# EAGLE design Clyde_main_board (EAGLE 6.4)
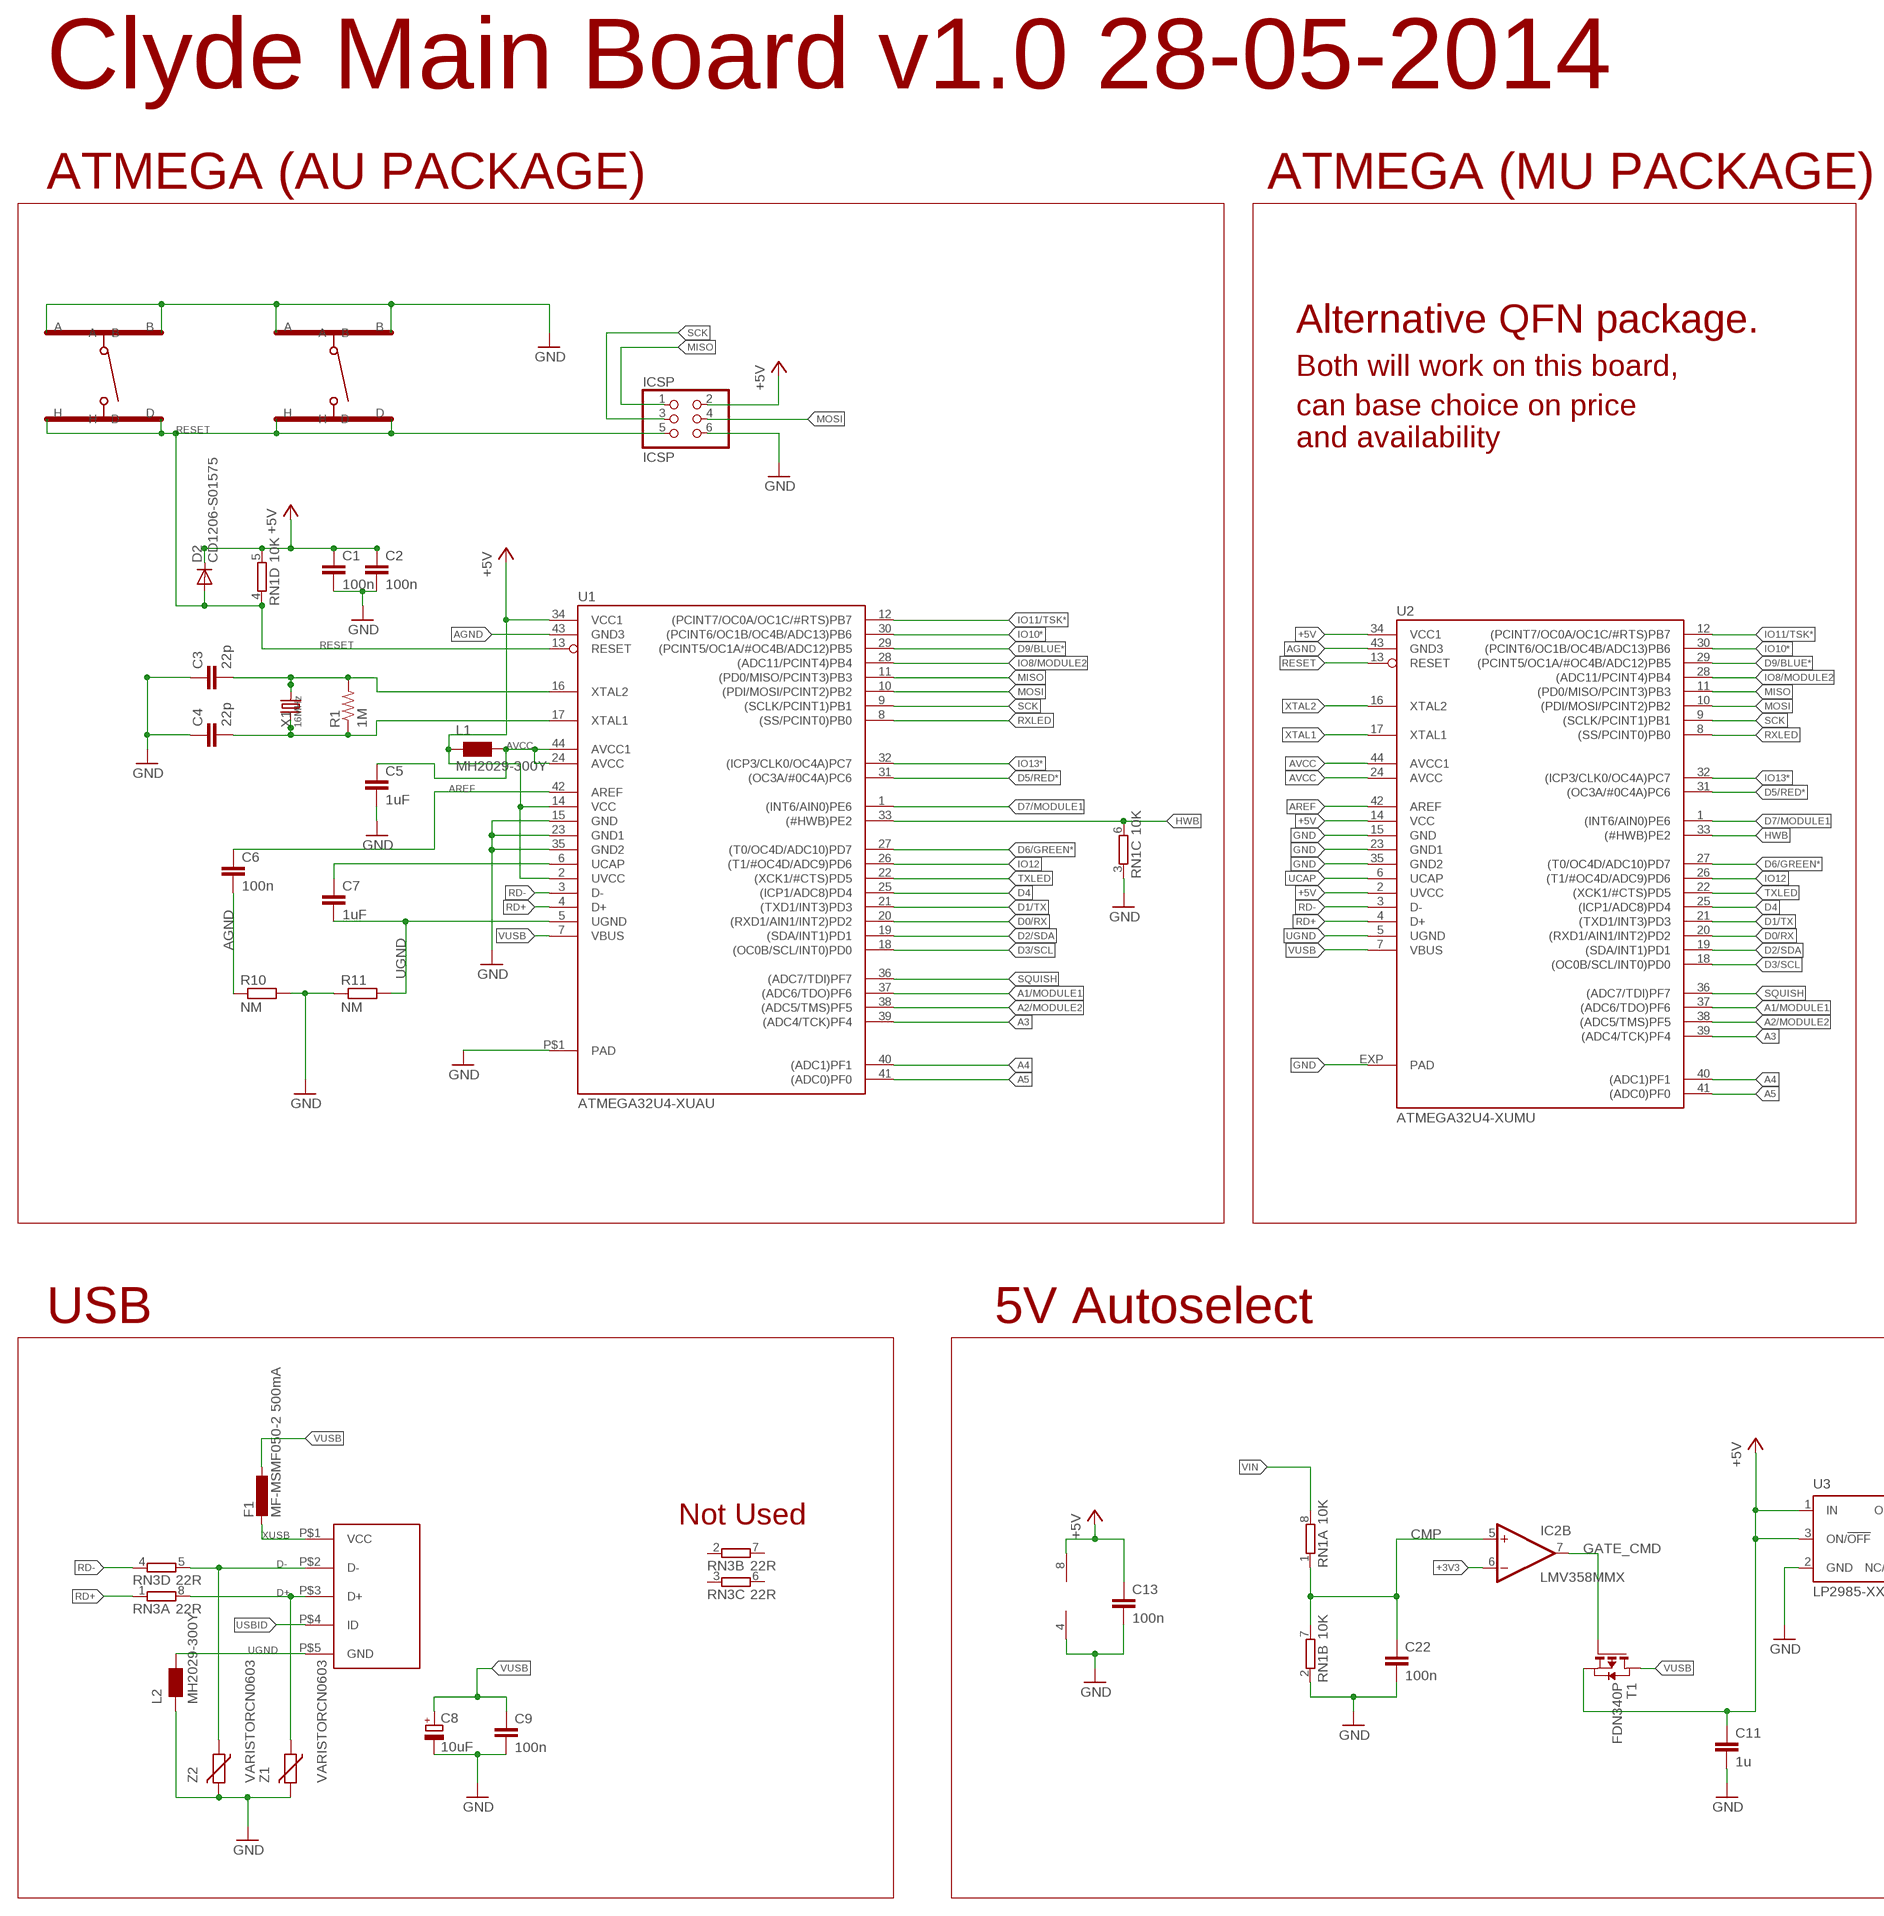
[diagram p0: schematic, sheet 1, part 1 of 2]
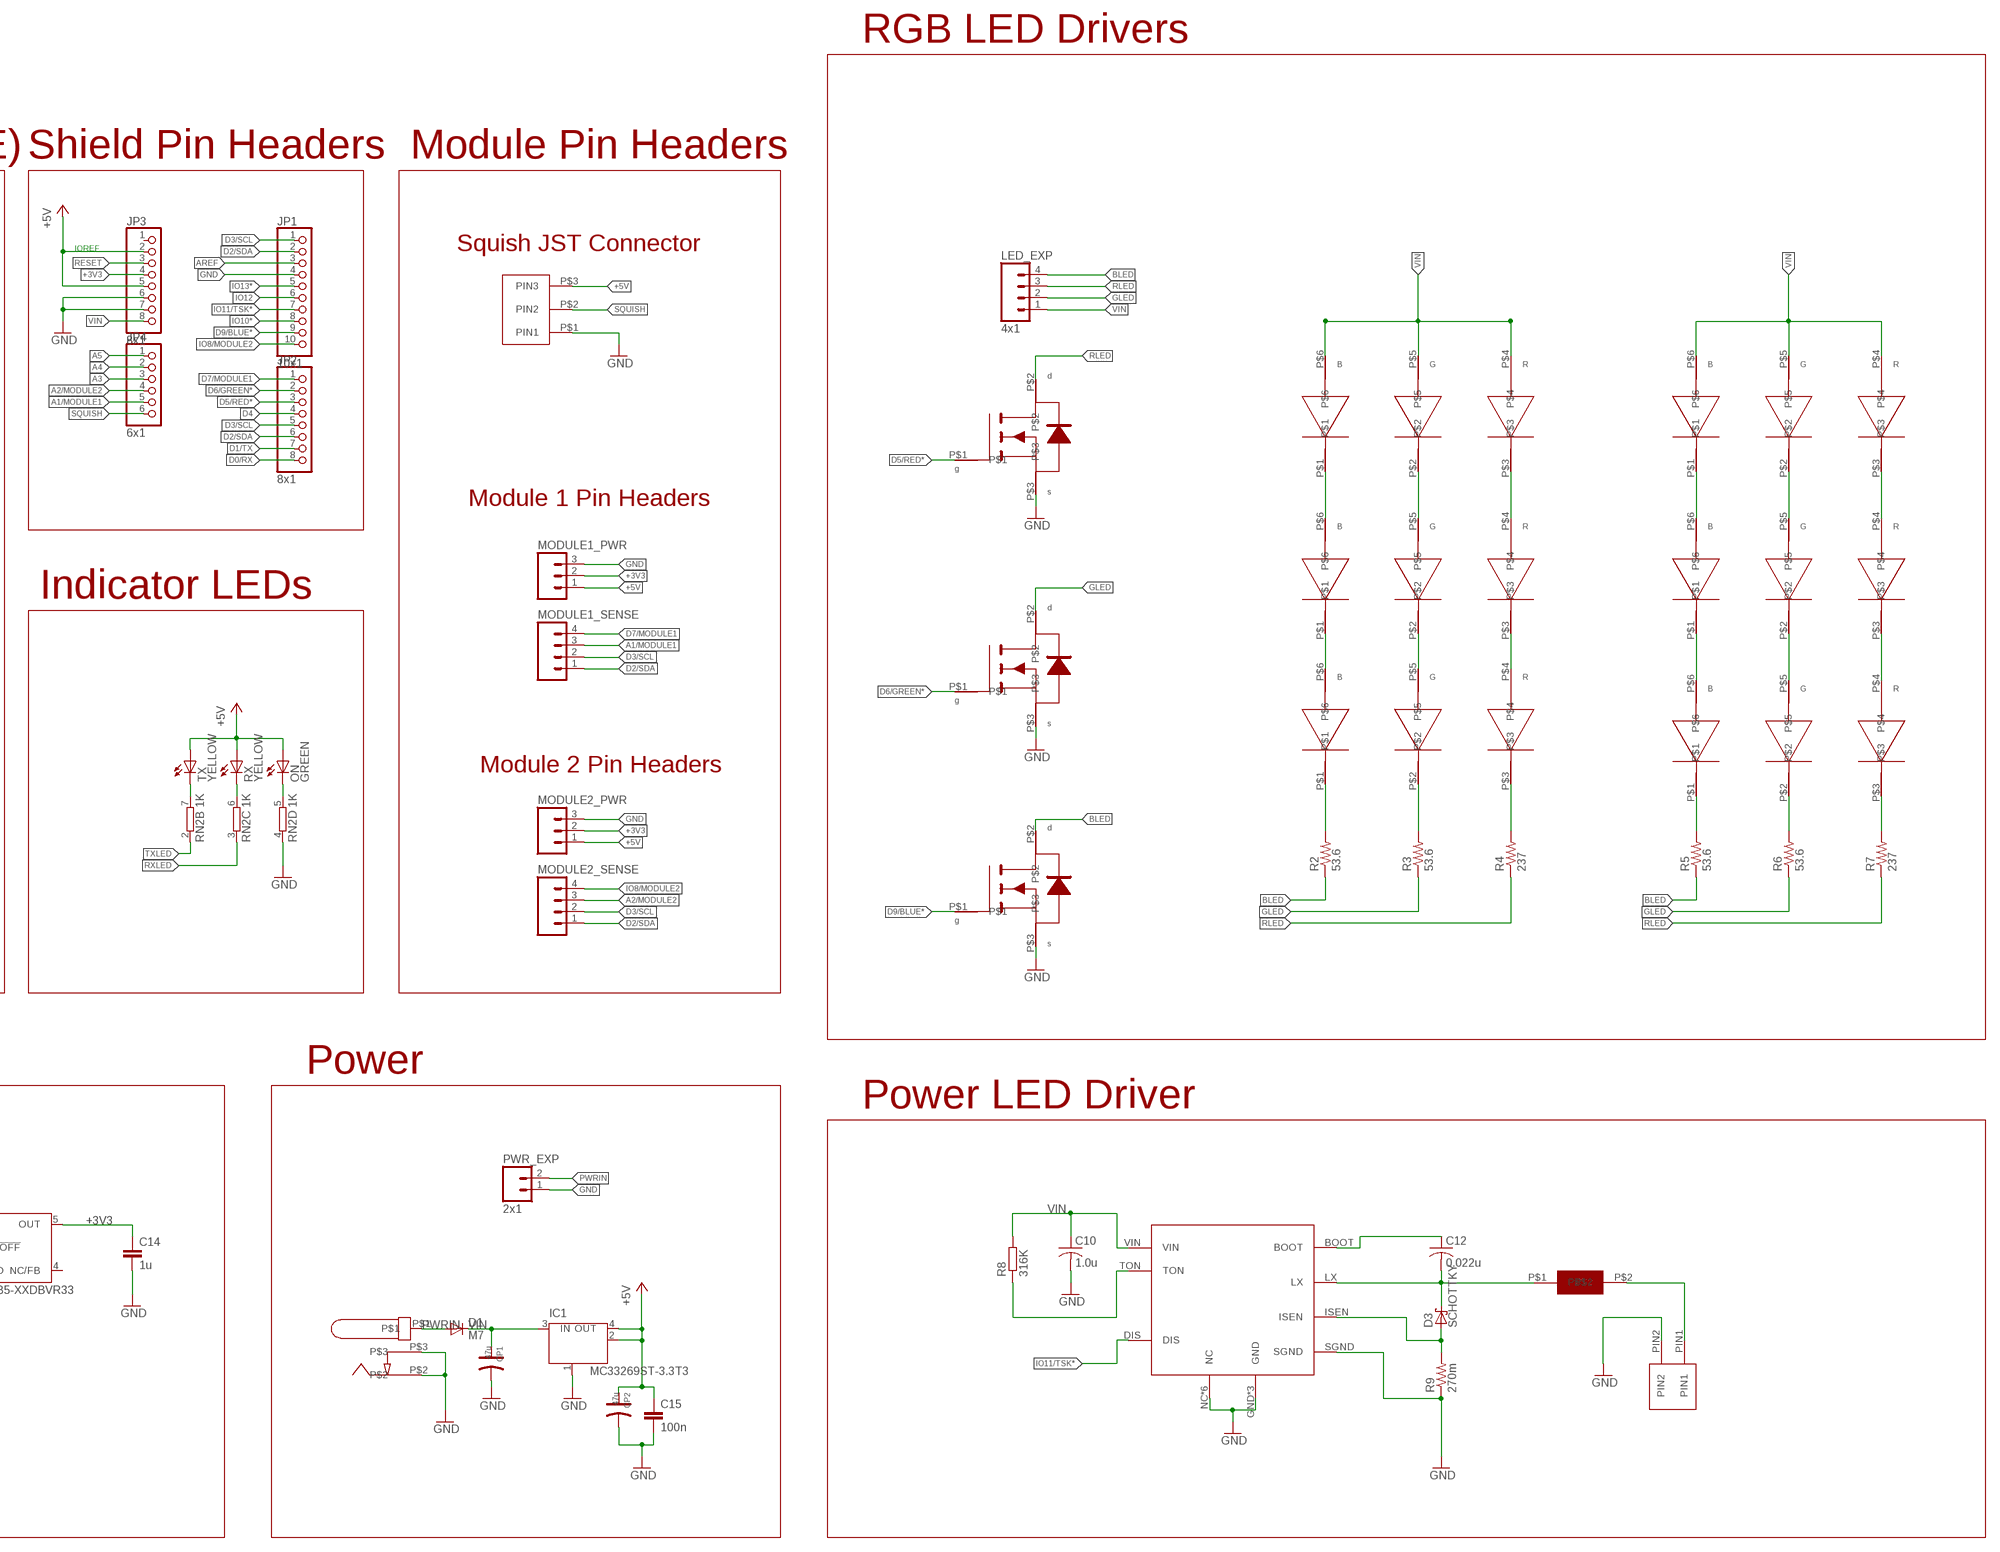
[diagram p1: schematic, sheet 1, part 2 of 2]

## Parts
2PIN_CONN  XH_JST_CONN_2POS_TOP  [XH_JST_CONN_2POS_TOP]
C1  100n  C-EUC0603  [C0603-ROUND]
C2  100n  C-EUC0603  [C0603-ROUND]
C3  22p  C-EUC0603  [C0603-ROUND]
C4  22p  C-EUC0603  [C0603-ROUND]
C5  1uF  C-EUC0603  [C0603-ROUND]
C6  100n  C-EUC0603  [C0603-ROUND]
C7  1uF  C-EUC0603  [C0603-ROUND]
C8  10uF  CPOL-EUSMCB  [SMC_B]
C9  100n  C-EUC0603  [C0603-ROUND]
C10  1.0u  C-USC1210  [C1210]
C11  1u  C-EUC0603  [C0603-ROUND]
C12  0.022u  C-USC0805  [C0805]
C13  100n  C-EUC0603  [C0603-ROUND]
C14  1u  C-EUC0603  [C0603-ROUND]
C15  100n  C-EUC0603  [C0603-ROUND]
C22  100n  C-EUC0603  [C0603-ROUND]
CP1  47u  CAP-ELECTRO-C  [ELECTRO-SMD-C-6MM]
CP2  47u  CAP-ELECTRO-C  [ELECTRO-SMD-C-6MM]
D1  M7  DIODE-SMB  [SMB]
D2  CD1206-S01575  DIODE-MINIMELF  [MINIMELF]
D3  SCHOTTKY  SCHOTTKY-DIODESMD  [SMB]
F1  MF-MSMF050-2 500mA  L-EUL1812  [L1812]
I_LEDDRIVER  TAIYO_YUDEN_6045_INDUCTOR  [TAIYO_YUDEN_6045_INDUCTOR]
IC1  MC33269ST-3.3T3  [SOT223]
IC2  LMV358MMX  [MSOP08]
ICSP  ICSP  PINHD-2X3  [2X03]
IR_CONNECT  XH_JST_CONN_3POS_SIDE_SMT  [XH_JST_CONN_3POS_SIDE_SMT]
J1  MOLEX_VERT_MINIUSB  [MOLEX_VERT_MINIUSB]
JP1  10x1  PINHD-1X10  [1X10]
JP2  8x1  PINHD-1X8  [1X08]
JP3  8x1  PINHD-1X8  [1X08]
JP4  6x1  PINHD-1X6  [1X06]
L1  MH2029-300Y  WE-CBF_0805  [0805]
L2  MH2029-300Y  WE-CBF_0805  [0805]
LED_EXP  4x1  M04LONGPADS  [1X04_LONGPADS]
MODULE1_PWR  M03PTH  [1X03]
MODULE1_SENSE  M04PTH  [1X04]
MODULE2_PWR  M03PTH  [1X03]
MODULE2_SENSE  M04PTH  [1X04]
ON  GREEN  LEDCHIPLED_0603  [CHIPLED_0603]
PWR_EXP  2x1  M023.5MM  [SCREWTERMINAL-3.5MM-2]
PWR_JACK  VERT_PWRJACK_PJ-006A_CUIINC  [VERT_PWRJACK_PJ-006A_CUIINC]
R1  1M  RESISTOR0805-RES  [0805]
R2  53.6  R-US_R0603  [R0603]
R3  53.6  R-US_R0603  [R0603]
R4  237  R-US_R0603  [R0603]
R5  53.6  R-US_R0603  [R0603]
R6  53.6  R-US_R0603  [R0603]
R7  237  R-US_R0603  [R0603]
R8  316K  R-EU_R0603  [R0603-ROUND]
R9  270m  R-US_R0805  [R0805]
R10  NM  R_0402_NM  [R0402_NM]
R11  NM  R_0402_NM  [R0402_NM]
RGB1  HANGZHOU_MULTICOLOR_3535WSA  [HANGZHOU_MULTCOLOR_3535WSZ]
RGB2  HANGZHOU_MULTICOLOR_3535WSA  [HANGZHOU_MULTCOLOR_3535WSZ]
RGB3  HANGZHOU_MULTICOLOR_3535WSA  [HANGZHOU_MULTCOLOR_3535WSZ]
RGB4  HANGZHOU_MULTICOLOR_3535WSA  [HANGZHOU_MULTCOLOR_3535WSZ]
RGB5  HANGZHOU_MULTICOLOR_3535WSA  [HANGZHOU_MULTCOLOR_3535WSZ]
RGB6  HANGZHOU_MULTICOLOR_3535WSA  [HANGZHOU_MULTCOLOR_3535WSZ]
RN1  10K  4R-NCAY16  [CAY16]
RN2  1K  4R-NCAY16  [CAY16]
RN3  22R  4R-NCAY16  [CAY16]
RST  COMAX_MINISWITCH  [COMAX_MINISWITCH]
RST1  COMAX_MINISWITCH  [COMAX_MINISWITCH]
RX  YELLOW  LEDCHIPLED_0603  [CHIPLED_0603]
T1  FDN340P  PMOSSOT23  [SOT-23]
TBLUE  SI2302DS_MOSFET  [SI2302DS_MOSFET]
TGREEN  SI2302DS_MOSFET  [SI2302DS_MOSFET]
TRED  SI2302DS_MOSFET  [SI2302DS_MOSFET]
TX  YELLOW  LEDCHIPLED_0603  [CHIPLED_0603]
U1  ATMEGA32U4-XUAU  [TQFP44-PAD]
U2  ATMEGA32U4-XUMU  [QFN44ML7X7]
U3  LP2985-XXDBVR33  [SOT23-DBV]
U4  ALLEGRO_A6210  [ALLEGRO_A6210]
X1  16MHz  XTAL_THRU_SMD  [XTAL_THRU_SMT]
Z1  VARISTORCN0603  [CT/CN0603]
Z2  VARISTORCN0603  [CT/CN0603]

## Nets
+3V3: C14.1 IC2.6(B:-IN) JP3.4 MODULE1_PWR.2 MODULE2_PWR.2 U3.5(OUT)
+5V: C1.1 C2.1 C11.1 C13.1 C15.1 CP2.+ D2.C IC1.2(OUT) IC1.4(OUT) IC2.8(P:V+) ICSP.2 IR_CONNECT.P$3(PIN3) JP3.2 JP3.5 L1.1 MODULE1_PWR.1 MODULE2_PWR.1 ON.A RN1.5 RX.A T1.2(S) TX.A U1.2(UVCC) U1.14(VCC) U1.34(VCC1) U2.2(UVCC) U2.14(VCC) U2.34(VCC1) U3.1(IN) U3.3(ON/!OFF)
A1/MODULE1: JP4.5 MODULE1_SENSE.3 U1.37((ADC6/TDO)PF6) U2.37((ADC6/TDO)PF6)
A2/MODULE2: JP4.4 MODULE2_SENSE.3 U1.38((ADC5/TMS)PF5) U2.38((ADC5/TMS)PF5)
A3: JP4.3 U1.39((ADC4/TCK)PF4) U2.39((ADC4/TCK)PF4)
A4: JP4.2 U1.40((ADC1)PF1) U2.40((ADC1)PF1)
A5: JP4.1 U1.41((ADC0)PF0) U2.41((ADC0)PF0)
AGND: C6.2 R10.1 U1.43(GND3) U2.43(GND3)
AREF: C6.1 JP1.3 U1.42(AREF) U2.42(AREF)
AVCC: C5.1 L1.2 U1.24(AVCC) U1.44(AVCC1) U2.24(AVCC) U2.44(AVCC1)
BLED: LED_EXP.4 R2.1 R5.1 TBLUE.P$2
CMP: C22.1 IC2.5(B:+IN) RN1.1 RN1.7
D0/RX: JP2.8 U1.20((RXD1/AIN1/INT2)PD2) U2.20((RXD1/AIN1/INT2)PD2)
D1/TX: JP2.7 U1.21((TXD1/INT3)PD3) U2.21((TXD1/INT3)PD3)
D2/SDA: JP1.2 JP2.6 MODULE1_SENSE.1 MODULE2_SENSE.1 U1.19((SDA/INT1)PD1) U2.19((SDA/INT1)PD1)
D3/SCL: JP1.1 JP2.5 MODULE1_SENSE.2 MODULE2_SENSE.2 U1.18((OC0B/SCL/INT0)PD0) U2.18((OC0B/SCL/INT0)PD0)
D4: JP2.4 U1.25((ICP1/ADC8)PD4) U2.25((ICP1/ADC8)PD4)
D5/RED*: JP2.3 TRED.P$1 U1.31((OC3A/#0C4A)PC6) U2.31((OC3A/#0C4A)PC6)
D6/GREEN*: JP2.2 TGREEN.P$1 U1.27((T0/OC4D/ADC10)PD7) U2.27((T0/OC4D/ADC10)PD7)
D7/MODULE1: JP2.1 MODULE1_SENSE.4 U1.1((INT6/AIN0)PE6) U2.1((INT6/AIN0)PE6)
D9/BLUE*: JP1.9 TBLUE.P$1 U1.29((PCINT5/OC1A/#OC4B/ADC12)PB5) U2.29((PCINT5/OC1A/#OC4B/ADC12)PB5)
D+: J1.P$3(D+) RN3.8 Z1.1
D-: J1.P$2(D-) RN3.5 Z2.1
GATE_CMD: IC2.7(B:OUT) T1.3(G)
GLED: LED_EXP.2 R3.1 R6.1 TGREEN.P$2
GND: 2PIN_CONN.PIN2 C1.2 C2.2 C3.1 C4.1 C5.2 C8.- C9.2 C10.2 C11.2 C13.2 C14.2 C15.2 C22.2 CP1.- CP2.- IC1.1(GND/ADJ) IC2.4(P:V-) ICSP.6 IR_CONNECT.P$1(PIN1) JP1.4 JP3.6 JP3.7 L2.1 MODULE1_PWR.3 MODULE2_PWR.3 PWR_EXP.1 PWR_JACK.P$2 PWR_JACK.P$3 R9.1 R10.2 R11.1 RN1.2 RN1.3 RN2.4 RST1.A RST1.B RST.A RST.B TBLUE.P$3 TGREEN.P$3 TRED.P$3 U1.15(GND) U1.23(GND1) U1.35(GND2) U1.P$1(PAD) U2.15(GND) U2.23(GND1) U2.35(GND2) U2.EXP(PAD) U3.2(GND) U4.GND U4.GND1(GND) U4.GND2(GND) U4.NC U4.NC1(NC) U4.NC2(NC) U4.NC3(NC) U4.NC4(NC) U4.NC5(NC) U4.SGND Z1.2 Z2.2
HWB: RN1.6 U1.33((#HWB)PE2) U2.33((#HWB)PE2)
IO8/MODULE2: JP1.10 MODULE2_SENSE.4 U1.28((ADC11/PCINT4)PB4) U2.28((ADC11/PCINT4)PB4)
IO10*: JP1.8 U1.30((PCINT6/OC1B/OC4B/ADC13)PB6) U2.30((PCINT6/OC1B/OC4B/ADC13)PB6)
IO11/TSK*: JP1.7 U1.12((PCINT7/OC0A/OC1C/#RTS)PB7) U2.12((PCINT7/OC0A/OC1C/#RTS)PB7) U4.DIS
IO12: JP1.6 U1.26((T1/#OC4D/ADC9)PD6) U2.26((T1/#OC4D/ADC9)PD6)
IO13*: JP1.5 U1.32((ICP3/CLK0/OC4A)PC7) U2.32((ICP3/CLK0/OC4A)PC7)
MISO: ICSP.1 U1.11((PD0/MISO/PCINT3)PB3) U2.11((PD0/MISO/PCINT3)PB3)
MOSI: ICSP.4 U1.10((PDI/MOSI/PCINT2)PB2) U2.10((PDI/MOSI/PCINT2)PB2)
N$5: R8.1 U4.TON
N$8: D3.A R9.2 U4.ISEN
N$9: C12.1 U4.BOOT
N$10: C12.2 D3.C I_LEDDRIVER.P$1 U4.LX
N$11: RN2.7 TX.C
N$12: RN2.6 RX.C
N$13: ON.C RN2.5
N$14: R2.2 RGB3.P$1
N$15: 2PIN_CONN.PIN1 I_LEDDRIVER.P$2
N$16: R3.2 RGB3.P$2
N$17: R4.2 RGB3.P$3
N$18: RGB2.P$1 RGB3.P$6
N$19: RGB2.P$2 RGB3.P$5
N$20: RGB2.P$3 RGB3.P$4
N$21: R5.2 RGB6.P$1
N$22: R6.2 RGB6.P$2
N$23: R7.2 RGB6.P$3
N$24: RGB5.P$1 RGB6.P$6
N$25: RGB5.P$2 RGB6.P$5
N$26: RGB5.P$3 RGB6.P$4
N$27: RGB4.P$3 RGB5.P$4
N$28: RGB4.P$2 RGB5.P$5
N$29: RGB4.P$1 RGB5.P$6
N$30: RGB1.P$3 RGB2.P$4
N$31: RGB1.P$2 RGB2.P$5
N$32: RGB1.P$1 RGB2.P$6
PWRIN: D1.A PWR_EXP.2 PWR_JACK.P$1
RD+: RN3.1 U1.4(D+) U2.4(D+)
RD-: RN3.4 U1.3(D-) U2.3(D-)
RESET: D2.A ICSP.5 JP3.3 RN1.4 RST1.D RST1.H RST.D RST.H U1.13(RESET) U2.13(RESET)
RLED: LED_EXP.3 R4.1 R7.1 TRED.P$2
RXLED: RN2.3 U1.8((SS/PCINT0)PB0) U2.8((SS/PCINT0)PB0)
SCK: ICSP.3 U1.9((SCLK/PCINT1)PB1) U2.9((SCLK/PCINT1)PB1)
SQUISH: IR_CONNECT.P$2(PIN2) JP4.6 U1.36((ADC7/TDI)PF7) U2.36((ADC7/TDI)PF7)
TXLED: RN2.2 U1.22((XCK1/#CTS)PD5) U2.22((XCK1/#CTS)PD5)
UCAP: C7.1 U1.6(UCAP) U2.6(UCAP)
UGND: C7.2 J1.P$5(GND) L2.2 R11.2 U1.5(UGND) U2.5(UGND)
USBID: J1.P$4(ID)
VIN: C10.1 CP1.+ D1.C IC1.3(IN) JP3.8 LED_EXP.1 R8.2 RGB1.P$4 RGB1.P$5 RGB1.P$6 RGB4.P$4 RGB4.P$5 RGB4.P$6 RN1.8 U4.VIN
VUSB: C8.+ C9.1 F1.1 T1.1(D) U1.7(VBUS) U2.7(VBUS)
XTAL1: C4.2 R1.1 U1.17(XTAL1) U2.17(XTAL1) X1.1 X1.P$1
XTAL2: C3.2 R1.2 U1.16(XTAL2) U2.16(XTAL2) X1.2 X1.P$2
XUSB: F1.2 J1.P$1(VCC)
Unconnected: IC2.1(A:OUT) IC2.2(A:-IN) IC2.3(A:+IN) JP3.1 RN2.1 RN2.8 RN3.2 RN3.3 RN3.6 RN3.7 U3.4(NC/FB)

## Notes on the sheet
- RGB LED Drivers
- Clyde Main Board v1.0 28-05-2014
- ATMEGA (AU PACKAGE) | ATMEGA (MU PACKAGE) | Shield Pin Headers | Module Pin Headers
- IOREF | Squish JST Connector
- Alternative QFN package.
- Both will work on this board,
- can base choice on price
  and availability
- Module 1 Pin Headers
- Indicator LEDs
- Module 2 Pin Headers
- USB | 5V Autoselect | Power
- Power LED Driver
- Not Used

## Library data of the parts
2PIN_CONN = fabule:XH_JST_CONN_2POS_TOP
C1-C7 C9 C11 C13-C15 C22 = SmartPrj:C-EU: CAPACITOR, European symbol
C8 = rcl:CPOL-EU: POLARIZED CAPACITOR, European symbol
C10 C12 = rcl:C-US: CAPACITOR, American symbol
CP1 CP2 = Discrete:CAP*: Electrolytic Capacitors,Tantalum Capacitors and Super Capacitors
D1 D2 = diode:DIODE-: DIODE
D3 = diode:SCHOTTKY-DIODE: Schottky Diode
F1 = rcl:L-EU: INDUCTOR, European symbol
I_LEDDRIVER = fabule:TAIYO_YUDEN_6045_INDUCTOR
IC1 = linear:MC33269ST*: Adjustable Output Low Dropout Voltage Regulator 800 mA Source: http://www.onsemi.com/pub/Collateral/MC33269-D.PDF
IC2 = linear:LMV358?*: Dual General Purpose, Low Voltage, Rail-to-Rail Output Operational Amplifiers Source: http://www.national.com/mpf/LM/LMV321.html http://www.national.com/dt/lmv_qual.pdf
ICSP = SmartPrj:PINHD-2X3: PIN HEADER
IR_CONNECT = fabule:XH_JST_CONN_3POS_SIDE_SMT
J1 = fabule:MOLEX_VERT_MINIUSB
JP1 = SmartPrj:PINHD-1X10: PIN HEADER
JP2 JP3 = SmartPrj:PINHD-1X8: PIN HEADER
JP4 = SmartPrj:PINHD-1X6: PIN HEADER
L1 L2 = wuerth-elektronik:WE-CBF: SMD EMI Suppression Ferrite Beads - excellent anti-EMI properties - low DCR - impedances till 3000 ohms - rated current up to 6 A
LED_EXP MODULE1_SENSE MODULE2_SENSE = SparkFun:M04: Header 4 Standard 4-pin 0.1" header. Use with straight break away headers (SKU : PRT-00116), right angle break away headers (PRT-00553), swiss pins (PRT-00743), machine pins (PRT-00117), and female headers (PRT-00115). Molex polarized connector foot print use with SKU : PRT-08231 with associated crimp pins and housings. 1MM SMD Version SKU: PRT-10208
MODULE1_PWR MODULE2_PWR = SparkFun:M03: Header 3 Standard 3-pin 0.1" header. Use with straight break away headers (SKU : PRT-00116), right angle break away headers (PRT-00553), swiss pins (PRT-00743), machine pins (PRT-00117), and female headers (PRT-00115). Molex polarized connector foot print use with SKU : PRT-08232 with associated crimp pins and housings.
ON RX TX = led:LED: LED OSRAM: - CHIPLED LG R971, LG N971, LY N971, LG Q971, LY Q971, LO R971, LY R971 LH N974, LH R974 LS Q976, LO Q976, LY Q976 LO Q996 - Hyper CHIPLED LW Q18S LB Q993, LB Q99A, LB R99A - SideLED LS A670, LO A670, LY A670, LG A670, LP A670 LB A673, LV A673, LT A673, LW A673 LH A674 LY A675 LS A676, LA A676, LO A676, LY A676, LW A676 LS A679, LY A679, LG A679 - Hyper Micro SIDELED® LS Y876, LA Y876, LO Y876, LY Y876 LT Y87S - SmartLED LW L88C, LW L88S LB L89C, LB L89S, LG L890 LS L89K, LO L89K, LY L89K LS L896, LA L896, LO L896, LY L896 - TOPLED LS T670, LO T670, LY T670, LG T670, LP T670 LSG T670, LSP T670, LSY T670, LOP T670, LYG T670 LG T671, LOG T671, LSG T671 LB T673, LV T673, LT T673, LW T673 LH T674 LS T676, LA T676, LO T676, LY T676, LB T676, LH T676, LSB T676, LW T676 LB T67C, LV T67C, LT T67C, LS T67K, LO T67K, LY T67K, LW E67C LS E67B, LA E67B, LO E67B, LY E67B, LB E67C, LV E67C, LT E67C LW T67C LS T679, LY T679, LG T679 LS T770, LO T770, LY T770, LG T770, LP T770 LB T773, LV T773, LT T773, LW T773 LH T774 LS E675, LA E675, LY E675, LS T675 LS T776, LA T776, LO T776, LY T776, LB T776 LHGB T686 LT T68C, LB T68C - Hyper Mini TOPLED® LB M676 - Mini TOPLED Santana® LG M470 LS M47K, LO M47K, LY M47K Source: http://www.osram.convergy.de LUXEON: - LUMILED® LXK2-PW12-R00, LXK2-PW12-S00, LXK2-PW14-U00, LXK2-PW14-V00 LXK2-PM12-R00, LXK2-PM12-S00, LXK2-PM14-U00 LXK2-PE12-Q00, LXK2-PE12-R00, LXK2-PE12-S00, LXK2-PE14-T00, LXK2-PE14-U00 LXK2-PB12-K00, LXK2-PB12-L00, LXK2-PB12-M00, LXK2-PB14-N00, LXK2-PB14-P00, LXK2-PB14-Q00 LXK2-PR12-L00, LXK2-PR12-M00, LXK2-PR14-Q00, LXK2-PR14-R00 LXK2-PD12-Q00, LXK2-PD12-R00, LXK2-PD12-S00 LXK2-PH12-R00, LXK2-PH12-S00 LXK2-PL12-P00, LXK2-PL12-Q00, LXK2-PL12-R00 Source: www.luxeon.com KINGBRIGHT: KA-3528ASYC Source: www.kingbright.com
PWR_EXP = SparkFun:M02: Header 2 Standard 2-pin 0.1" header. Use with straight break away headers (SKU : PRT-00116), right angle break away headers (PRT-00553), swiss pins (PRT-00743), machine pins (PRT-00117), and female headers (PRT-00115). Molex polarized connector foot print use with SKU : PRT-08233 with associated crimp pins and housings.
PWR_JACK = fabule:VERT_PWRJACK_PJ-006A_CUIINC
R1 = SparkFun:RESISTOR: Resistor Basic schematic elements and footprints for 0603, 1206, and PTH resistors.
R2-R7 = rcl:R-US_: RESISTOR, American symbol
R8 = SmartPrj:R-EU_: RESISTOR, European symbol
R9 = resistor:R-US_: RESISTOR, American symbol
R10 R11 = fabule:R_0402_NM
RGB1-RGB6 = fabule:HANGZHOU_MULTICOLOR_3535WSA
RN1-RN3 = resistor-dil:4R-N: Array Chip Resistor Source: RS Component / Phycomp; OC_FARNELL: unknown; OC_NEWARK: unknown
RST RST1 = fabule:COMAX_MINISWITCH
T1 = zetex:PMOSSOT23: MOS FET; OC_FARNELL: unknown; OC_NEWARK: unknown
TBLUE TGREEN TRED = fabule:SI2302DS_MOSFET
U1 U2 = SmartPrj:ATMEGA32U4-XU
U3 = SmartPrj:LP2985-XXDBVR: ULTRALOW-POWER 50-mA LOW-DROPOUT LINEAR REGULATORS 50-mA Low-Dropout Regulator Source: http://focus.ti.com/lit/ds/symlink/tps77001.pdf
U4 = fabule:ALLEGRO_A6210
X1 = fabule:XTAL_THRU_SMD
Z1 Z2 = varistor:VARISTOR: VARISTOR

## Board
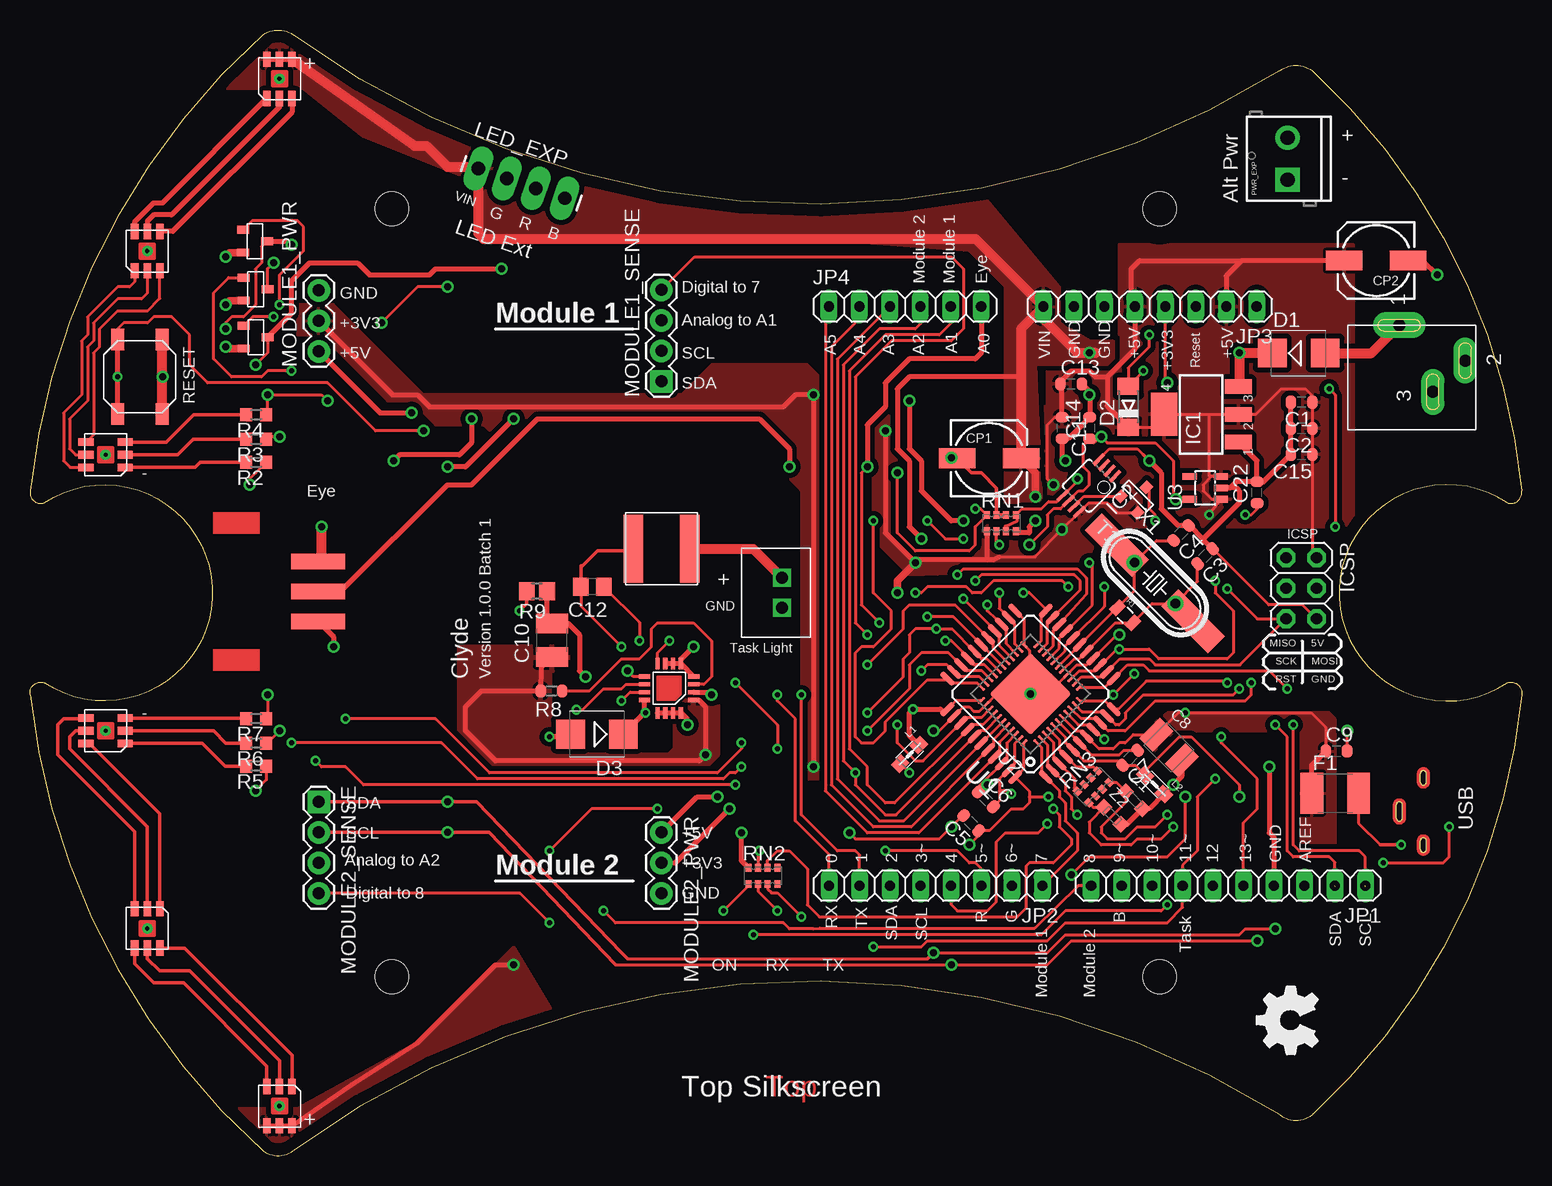
[diagram p2: board, top side]
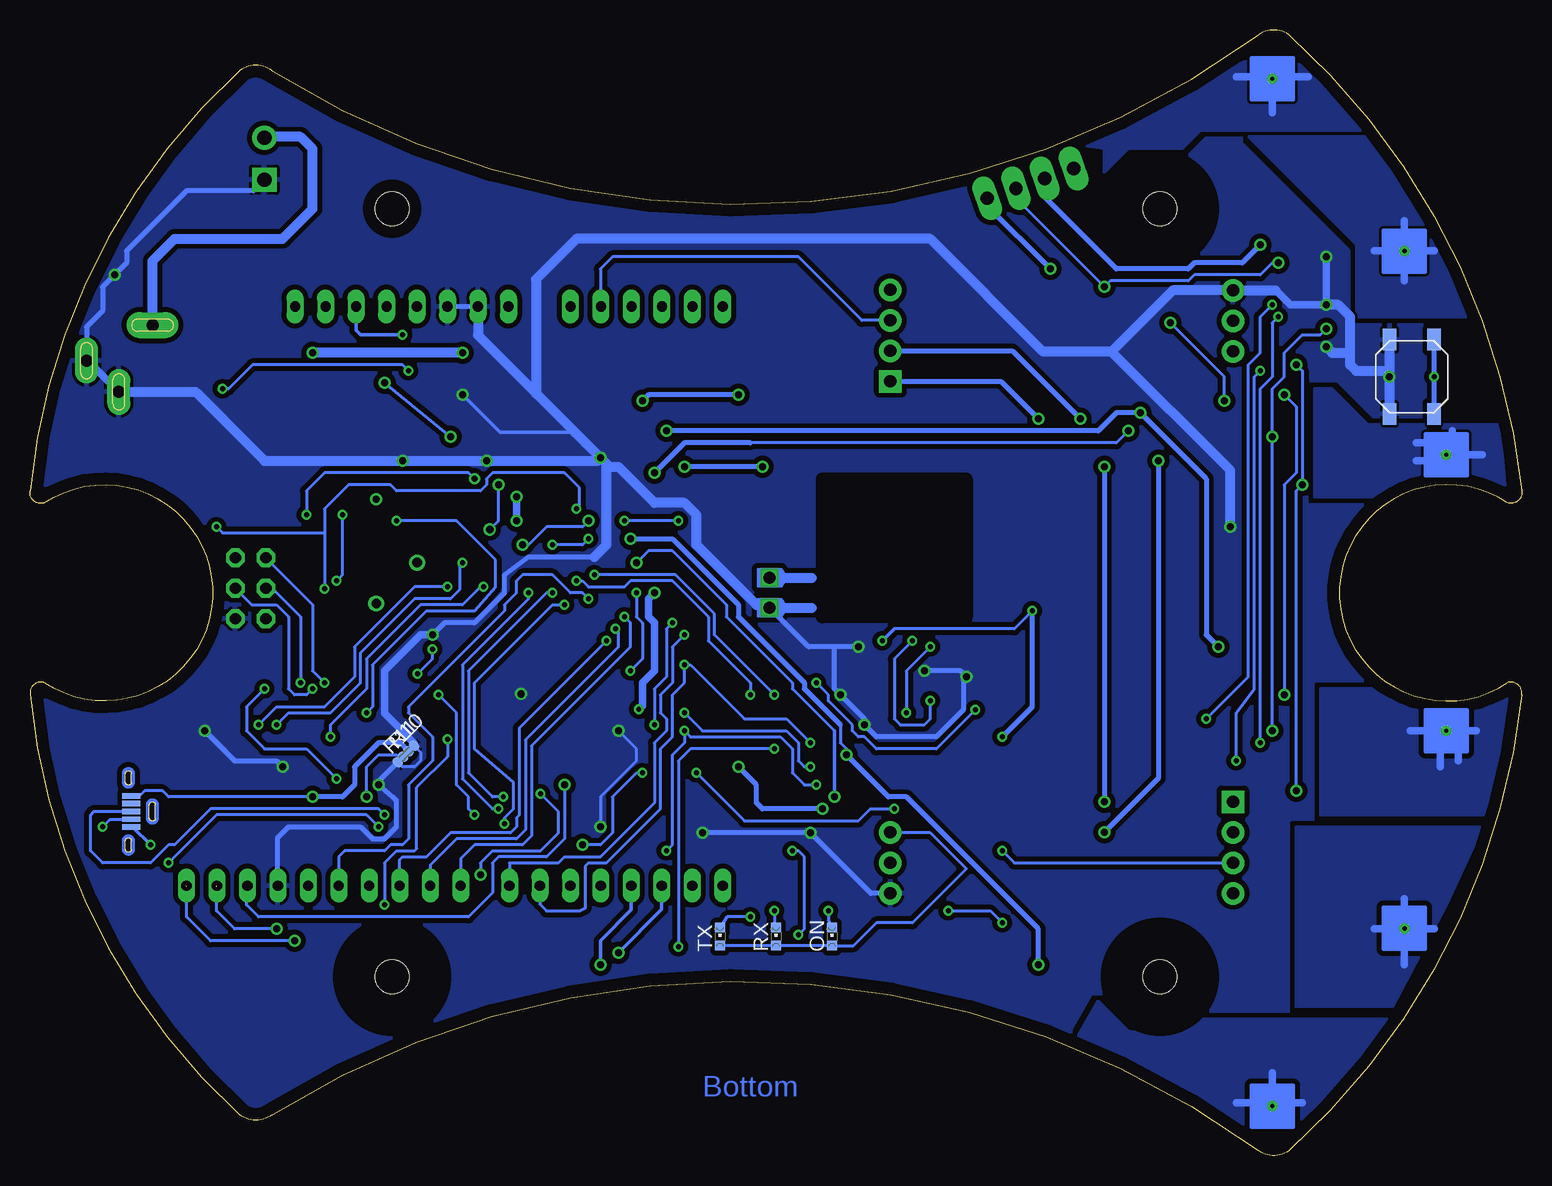
[diagram p3: board, bottom side, seen from below]

Size 124.36 x 93.8 mm. Coordinates in mm from the lower left corner, seen from the top.
Outline: 21.93,93.4 arc68 104.18,90.4 arc-75 106.89,90.4 arc-42 124.34,55.4 arc-120 123.15,54.4 arc247 123.15,39.4 arc-120 124.34,38.4 arc-42 106.89,3.4 arc-75 104.18,3.4 arc68 21.93,0.4 arc-71 19.43,0.4 arc-42 0.01,38.4 arc-120 1.19,39.4 arc247 1.19,54.4 arc-120 0.01,55.4 arc-42 19.43,93.4 arc-71 21.93,93.4
Copper layers (1*16): Top 0.035mm / dielectric 1.5mm / Bottom 0.035mm
Design rules "default *": minimum track width 10mil, minimum drill 0.3mm, track to track 8mil, track to pad 8mil, pad to pad 8mil, via to via 8mil, smd to smd 0mil, copper to edge 40mil, drill to drill 8mil, minimum pad ring 10mil, minimum via ring 8mil, stop-mask expansion 5mil, vias tented up to drill 0.6mm, thermal gap 10mil
Holes 2.8 mm at 94.17,78.9 94.17,14.9 30.17,78.9 30.17,14.9
tKeepout: area 91.6,76.4 to 96.7,81.4; area 91.6,12.4 to 96.7,17.4; area 27.6,76.4 to 32.7,81.4; area 27.6,12.4 to 32.7,17.4
bKeepout: area 89.7,74.4 to 98.7,83.4; area 25.7,74.4 to 34.7,83.4; area 89.7,74.4 to 98.7,83.4; area 25.7,10.4 to 34.7,19.4
tRestrict: area 27.6,76.4 to 32.7,81.4; area 91.6,12.4 to 96.7,17.4; area 91.6,76.4 to 96.7,81.4; area 27.6,12.4 to 32.7,17.4
bRestrict: area 89.7,10.4 to 98.7,19.4; area 25.7,74.4 to 34.7,83.4; area 89.7,10.4 to 98.7,19.4; area 25.7,10.4 to 34.7,19.4; area 46.3,44.9 to 58.3,56.4

### Footprints (pad centres in the part's own frame; a part is rotated, then mirrored left to right if it is on the bottom)
XH_JST_CONN_2POS_TOP = drill 1 square: PIN1 -1.25,0; PIN2 1.25,0
C0603-ROUND = smd 0.898 x 1.1: 1 -0.889,0; 2 0.889,0
SMC_B = smd 1.6 x 2.4: + -1.5,0; - 1.5,0
C1210 = smd 1.6 x 2.7: 1 -1.4,0; 2 1.4,0
C0805 = smd 1.3 x 1.5: 1 -0.95,0; 2 0.95,0
ELECTRO-SMD-C-6MM = smd 3.048 x 1.651: + 2.667,0; - -2.667,0
SMB = smd 2.4 x 2.4: A 2.2,0; C -2.2,0
MINIMELF = smd 1.4 x 1.8: A 1.7,0; C -1.7,0
L1812 = smd 1.9 x 3.4: 1 -1.95,0; 2 1.95,0
TAIYO_YUDEN_6045_INDUCTOR = smd 1.6 x 5.7: P$1 -2.35,0; P$2 2.35,0
SOT223 = smd 1.219 x 2.235: 1 -2.311,-3.099; 2 0,-3.099; 3 2.311,-3.099 | smd 3.6 x 2.2: 4 0,3.099
MSOP08 = smd 0.3 x 1.2: 1 -0.976,-2.113; 2 -0.326,-2.113; 3 0.324,-2.113; 4 0.974,-2.113; 5 0.974,2.112; 6 0.324,2.112; 7 -0.326,2.112; 8 -0.976,2.112
2X03 = drill 0.95 pad 1.55 octagon: 1 -2.54,-1.27; 2 -2.54,1.27; 3 0,-1.27; 4 0,1.27; 5 2.54,-1.27; 6 2.54,1.27
XH_JST_CONN_3POS_SIDE_SMT = smd 1.3 x 4.5: P$1 -2.5,2.25; P$2 0,2.25; P$3 2.5,2.25
MOLEX_VERT_MINIUSB = smd 0.45 x 1.5: P$1 -1.3,0.75; P$2 -0.65,0.75; P$3 0,0.75; P$4 0.65,0.75; P$5 1.3,0.75
1X10 = drill 0.85 pad 1.422 long: 1 -11.43,0; 2 -8.89,0; 3 -6.35,0; 4 -3.81,0; 5 -1.27,0; 6 1.27,0; 7 3.81,0; 8 6.35,0; 9 8.89,0; 10 11.43,0
1X08 = drill 0.85 pad 1.422 long: 1 -8.89,0; 2 -6.35,0; 3 -3.81,0; 4 -1.27,0; 5 1.27,0; 6 3.81,0; 7 6.35,0; 8 8.89,0
1X06 = drill 0.85 pad 1.422 long: 1 -6.35,0; 2 -3.81,0; 3 -1.27,0; 4 1.27,0; 5 3.81,0; 6 6.35,0
0805 = smd 1.2 x 1: 1 -1.1,0; 2 1.1,0
1X04_LONGPADS = drill 1.118 pad 1.88 long: 1 0,0; 2 2.54,0; 3 5.08,0; 4 7.62,0
1X03 = drill 1.016 pad 1.88: 1 0,0; 2 2.54,0; 3 5.08,0
1X04 = drill 1.016 pad 1.88 square: 1 0,0 | drill 1.016 pad 1.88: 2 2.54,0; 3 5.08,0; 4 7.62,0
CHIPLED_0603 = smd 0.8 x 0.8: A 0,-0.75; C 0,0.75
SCREWTERMINAL-3.5MM-2 = drill 1.2 pad 2.032 square: 1 0,0 | drill 1.2 pad 2.032: 2 3.5,0
VERT_PWRJACK_PJ-006A_CUIINC = drill 1 pad 2.184 long: P$1 4.35,0 | drill 1 pad 1.93 long: P$2 1.4,-5.5; P$3 -1.2,-2.8
0805' = smd 0.8 x 1.2: 1 -0.9,0; 2 0.9,0
R0603 = smd 1 x 1.1: 1 -0.85,0; 2 0.85,0
R0603-ROUND = smd 0.898 x 1.1: 1 -0.889,0; 2 0.889,0
R0805 = smd 1.3 x 1.5: 1 -0.85,0; 2 0.85,0
R0402_NM = smd 0.7 x 0.9: 1 -0.65,0; 2 0.65,0
HANGZHOU_MULTCOLOR_3535WSZ = smd 1.27 x 0.635: P$1 -1.635,1.05; P$2 -1.635,0; P$3 -1.635,-1.05; P$4 1.635,-1.05; P$5 1.635,0; P$6 1.635,1.05 | drill 0.35 pad 0.406: P$7 0,0
CAY16 = smd 0.5 x 0.65: 1 -1.2,-0.675; 2 -0.4,-0.675; 3 0.4,-0.675; 4 1.2,-0.675; 5 1.2,0.675; 6 0.4,0.675; 7 -0.4,0.675; 8 -1.2,0.675
COMAX_MINISWITCH = smd 1.8 x 1.1: A -3.1,-1.85; B 3.1,-1.85; D 3.1,1.85; H -3.1,1.85
SOT-23 = smd 0.787 x 0.889: 1 0.025,-1.016; 2 -0.94,1.016; 3 0.991,1.016
SI2302DS_MOSFET = smd 0.65 x 1: P$1 -0.95,-1; P$2 0,1; P$3 0.95,-1
TQFP44-PAD = smd 1.4 x 0.45: 1 -5.8,4; 2 -5.8,3.2; 3 -5.8,2.4; 4 -5.8,1.6; 5 -5.8,0.8; 6 -5.8,0; 7 -5.8,-0.8; 8 -5.8,-1.6; 9 -5.8,-2.4; 10 -5.8,-3.2; 11 -5.8,-4; 23 5.8,-4; 24 5.8,-3.2; 25 5.8,-2.4; 26 5.8,-1.6; 27 5.8,-0.8; 28 5.8,0; 29 5.8,0.8; 30 5.8,1.6; 31 5.8,2.4; 32 5.8,3.2; 33 5.8,4 | smd 0.45 x 1.4: 12 -4,-5.8; 13 -3.2,-5.8; 14 -2.4,-5.8; 15 -1.6,-5.8; 16 -0.8,-5.8; 17 0,-5.8; 18 0.8,-5.8; 19 1.6,-5.8; 20 2.4,-5.8; 21 3.2,-5.8; 22 4,-5.8; 34 4,5.8; 35 3.2,5.8; 36 2.4,5.8; 37 1.6,5.8; 38 0.8,5.8; 39 0,5.8; 40 -0.8,5.8; 41 -1.6,5.8; 42 -2.4,5.8; 43 -3.2,5.8; 44 -4,5.8 | smd 1 x 1: P$1 0,0
QFN44ML7X7 = smd 0.75 x 0.275: 1 -3.275,2.5; 2 -3.275,2; 3 -3.275,1.5; 4 -3.275,1; 5 -3.275,0.5; 6 -3.275,0; 7 -3.275,-0.5; 8 -3.275,-1; 9 -3.275,-1.5; 10 -3.275,-2; 11 -3.275,-2.5; 23 3.275,-2.5; 24 3.275,-2; 25 3.275,-1.5; 26 3.275,-1; 27 3.275,-0.5; 28 3.275,0; 29 3.275,0.5; 30 3.275,1; 31 3.275,1.5; 32 3.275,2; 33 3.275,2.5 | smd 0.275 x 0.75: 12 -2.5,-3.275; 13 -2,-3.275; 14 -1.5,-3.275; 15 -1,-3.275; 16 -0.5,-3.275; 17 0,-3.275; 18 0.5,-3.275; 19 1,-3.275; 20 1.5,-3.275; 21 2,-3.275; 22 2.5,-3.275; 34 2.5,3.275; 35 2,3.275; 36 1.5,3.275; 37 1,3.275; 38 0.5,3.275; 39 0,3.275; 40 -0.5,3.275; 41 -1,3.275; 42 -1.5,3.275; 43 -2,3.275; 44 -2.5,3.275 | smd 4.826 x 4.826: EXP 0,0
SOT23-DBV = smd 0.55 x 1.2: 1 -0.95,-1.3; 2 0,-1.3; 3 0.95,-1.3; 4 0.95,1.3; 5 -0.95,1.3
ALLEGRO_A6210 = smd 0.95 x 0.35: BOOT 2.05,0.325; DIS 2.05,-0.325; GND -2.05,-0.975; LX 2.05,0.975; NC -2.05,0.325; SGND 2.05,-0.975; TON -2.05,-0.325; VIN -2.05,0.975 | smd 0.35 x 0.95: GND1 -0.975,-2.05; GND2 -0.325,-2.05; ISEN 0.975,-2.05; NC1 -0.975,2.05; NC2 -0.325,2.05; NC3 0.325,2.05; NC4 0.975,2.05; NC5 0.325,-2.05
XTAL_THRU_SMT = drill 0.813: 1 -2.413,0; 2 2.413,0 | smd 5.5 x 2: P$1 -4.5,0; P$2 4.5,0
CT/CN0603 = smd 1 x 1: 1 -1,0; 2 1,0

### Placement (x,y rotation side)
2PIN_CONN  62.7,46.9 270 top
C1  106,62.78 180 top
C2  106,60.6 180 top
C3  97.96,49.94 225 top
C4  95.96,51.88 225 top
C5  78.46,27.7 135 top
C6  79.68,29.69 315 top
C7  91.71,33.14 225 top
C8  94.95,34.01 315 top
C9  108.9,33.7 0 top
C10  43.52,42.94 90 top
C11  86.03,60.63 270 top
C12  46.87,47.41 180 top
C13  86.8,64.3 0 top
C14  88.34,60.63 90 top
C15  106,58.43 180 top
C22  102.28,55.25 90 top
CP1  79.94,58.1 0 top
CP2  112.21,74.58 180 top
D1  105.75,66.87 0 top
D2  91.55,62.4 90 top
D3  47.25,35.1 180 top
F1  108.79,30.2 0 top
I_LEDDRIVER  52.64,50.56 0 top
IC1  97.63,61.76 90 top
IC2  88.28,55.81 135 top
ICSP  105.97,47.27 270 top
IR_CONNECT  21.76,47.01 270 top
J1  115.15,28.67 90 bottom
JP1  99.89,22.49 180 top
JP2  75.5,22.49 180 top
JP3  93.37,70.75 180 top
JP4  72.95,70.75 0 top
L1  73.32,33.43 225 top
L2  93.74,30.92 135 top
LED_EXP  37.36,82.26 341 top
MODULE1_PWR  24.07,67.02 90 top
MODULE1_SENSE  52.64,64.52 90 top
MODULE2_PWR  52.64,26.93 270 top
MODULE2_SENSE  24.07,29.47 270 top
ON  57.5,18.25 0 bottom
PWR_EXP  104.83,81.32 90 top
PWR_JACK  114.14,64.84 90 top
R1  1M  [0805']  91.3,45.02 315 top
R2  18.85,57.77 180 top
R3  18.85,59.69 180 top
R4  18.85,61.73 180 top
R5  18.85,32.45 180 top
R6  18.85,34.37 180 top
R7  18.85,36.41 180 top
R8  43.47,38.73 180 top
R9  42.25,47.02 180 top
R10  92.79,33.69 45 bottom
R11  93.24,33.24 45 bottom
RGB1  20.8,89.73 90 top
RGB2  9.78,75.37 90 top
RGB3  6.3,58.4 180 top
RGB4  20.8,4.13 270 top
RGB5  9.78,18.92 270 top
RGB6  6.3,35.4 180 top
RN1  80.97,52.7 180 top
RN2  61.09,23.3 180 top
RN3  88.63,30.72 225 top
RST  9.17,64.9 270 bottom
RST1  9.17,64.9 90 top
RX  62.17,18.25 0 bottom
T1  92.36,54.95 135 top
TBLUE  18.82,68.2 270 top
TGREEN  18.76,76.2 270 top
TRED  18.81,72.2 270 top
TX  66.84,18.25 0 bottom
U1  83.41,38.47 135 top
U2  83.41,38.47 135 top
U3  97.97,55.64 90 top
U4  53.28,38.94 180 top
U$1  [OSHW_FILLX200_NOTEXT]  107.34,8.44 90 top
X1  93.78,47.71 315 top
Z1  92.04,29.62 315 top
Z2  90.23,28.31 315 top

### Tracks (layer width: path | path; a pad name or v marks a point on that pad's centre or on a via)
+3V3  (via drill 0.6)
  Top 0.254: v95.51,54.69 95.3,54.9 95.3,57.9 93.8,59.4 89.8,59.4 v89.3,59.9 88.68,59.4 C14.1 87.8,59.2 87.8,57.4 88.3,56.9 88.3,55.9 87.8,55.4 87.41,55.4 IC2.6 85.91,53.9 85.3,53.9 84.8,53.4 84.8,52.4 v83.3,50.9 | v94.8,64.4 94.64,64.56 JP3.4
  Top 0.406: MODULE2_PWR.2 53.8,24.39 v58.3,28.9 | v73.3,62.9 73.3,58.9 74.3,57.9 74.3,55.4 76.8,52.9 v77.8,52.9 | MODULE1_PWR.2 30.23,63.4 32.3,63.4 33.3,62.4 62.8,62.4 63.8,63.4 v65.3,63.4 v65.3,32.4 | U3.5 v95.51,54.69
  Bottom 0.254: v89.3,59.9 v94.8,64.4 | v83.3,50.9 82.8,50.9 81.3,52.4 78.3,52.4 v77.8,52.9
  Bottom 0.406: v65.3,63.4 72.8,63.4 v73.3,62.9 | v58.3,28.9 63.3,28.9 63.8,29.4 63.8,30.9 v65.3,32.4
  pour Top (isolate 0.406, rank 3): 22.3,70.9 22.3,68.4 24.3,68.4 29.8,62.9 31.8,62.9 33.8,60.9 37.8,60.9 40.8,57.9 61.8,57.9 64.3,55.4 64.3,31.9 64.8,31.4 65.8,31.4 65.8,64.9 64.8,65.9 56.8,65.9 54.3,63.4 32.8,63.4 25.3,70.9
+5V  (via drill 0.4, 0.6)
  Top 0.254: C13.1 85.91,61.64 C11.1 85.42,61.52 84.8,60.9 84.8,56.4 v85.3,55.9 | D2.C 93.47,60.7 IC1.4 98.3,61.76 | 98.3,61.76 IC1.2 102.17,61.76 104.3,63.9 106.3,63.9 106.8,63.4 106.8,62.36 C1.1 C2.1 C15.1 106.89,50.17 ICSP.2 | 98.3,61.76 98.3,56.62 U3.3 98.5,56.59 97.8,55.9 97.8,55.4 98.51,54.69 U3.1 98.27,53.43 v98.3,53.4 | 76.18,36.9 U1.34 77.18,37.9 79.3,37.9 U2.34 | 89.21,40.8 U1.14 88.73,40.4 | 73.6,34.71 L1.1 | 80.8,49.9 83.75,49.9 | 83.75,49.9 83.8,49.9 | 88.73,40.4 87.46,40.4 U2.14 | U2.2 84.8,34.25 84.8,32.55 U1.2 86.3,31.05 86.3,30.4 86.8,29.9 86.8,28.9 v87.3,28.4 | 88.73,40.4 88.8,40.4 90.6,42.2 v90.8,42.2 93.3,42.2 94.1,41.4 99.8,41.4 100.3,41.9 100.3,45.4 98.8,46.9 v98.8,47.9 | v92.05,40.15 v90.3,38.4 | T1.2 90.63,53.57 89.8,54.4 88.25,54.4 IC2.8 v86.03,52.17 83.75,49.9
  Top 0.406: MODULE2_PWR.1 55.61,29.9 v57.3,29.9 | MODULE1_PWR.1 29.19,61.9 v31.8,61.9 | v71.3,60.4 71.3,51.9 v73.8,49.4 74.05,49.65 79.8,49.65 | 89.8,64.9 92.1,67.19 JP3.5 91.8,71.04 91.8,73.9 92.49,74.58 100.99,74.58 | 89.8,64.9 89.8,62.45 D2.C | C11.1 86.03,64.17 85.8,64.4 86.8,65.4 88.3,65.4 88.8,64.9 89.8,64.9 | CP2.+ 100.99,74.58 | 100.99,74.58 99.72,73.31 JP3.2 | 76.18,36.9 75.88,37.2 v73.6,37.2 73.3,36.9 73.3,35 L1.1 | 80.8,49.9 80.3,49.65 79.8,49.65 | RN1.5 79.77,49.68 79.8,49.65 | IR_CONNECT.P$3 25.3,43.21 v25.3,42.4
  Top 0.61: v73.8,49.4 72.3,47.9 v72.3,46.9
  Bottom 0.254: TX.A RX.A ON.A 55.7,17.5 53.8,19.4 50.8,19.4 46.3,23.9 49.34,26.93 MODULE2_PWR.1 | 57.3,35.4 60.8,38.9 60.8,39.4 66.3,44.9 66.3,45.9 70.8,50.4 72.8,50.4 v73.8,49.4 | v85.3,55.9 85.3,52.9 v86.03,52.17 | v98.8,47.9 98.3,48.4 v98.3,53.4 | v87.3,28.4 87.8,28.9 87.8,29.9 88.8,30.9 88.8,36.9 v90.3,38.4 | v92.05,40.15 90.8,41.4 v90.8,42.2 | v86.03,52.17
  Bottom 0.305: v57.3,29.9 57.3,35.4
  Bottom 0.406: v71.3,60.4 35.3,60.4 33.8,61.9 v31.8,61.9 26.3,56.4 26.3,43.4 v25.3,42.4
  Bottom 0.61: v72.3,46.9 72.8,46.4 72.8,44.9 72.3,44.4 72.3,40.4 73.3,39.4 73.3,37.49 v73.6,37.2
  pour Top (isolate 0.406, rank 2): 70.3,51.4 73.3,48.4 87.8,48.9 89.3,52.4 110.3,52.4 110.3,75.9 90.8,75.9 90.8,66.9 89.8,65.4 84.8,65.4 84.8,62.4 70.3,62.4
A1/MODULE1
  Top 0.254: JP4.5 76.76,69.35 75.8,68.4 71.3,68.4 68.3,65.4 68.3,33.9 69.8,32.4 69.8,30.9 71.3,29.4 72.07,29.4 U1.37 78.57,35.9 79.42,35.9 U2.37
  Bottom 0.254: MODULE1_SENSE.3 55,69.6 60.3,74.9 75.8,74.9 76.8,73.9 76.8,70.79 JP4.5
A2/MODULE2  (via drill 0.4)
  Top 0.254: JP4.4 74.22,69.31 73.8,68.9 70.8,68.9 67.8,65.9 67.8,32.9 v68.8,31.9 68.8,30.9 71.3,28.4 72.21,28.4 U1.38 | 78.74,34.84 U1.38 | v52.3,28.9 46.8,28.9 v43.3,25.4 | U2.38 79.63,35.4 79.21,35.4 U1.38
  Bottom 0.254: v68.8,31.9 64.8,27.9 55.3,27.9 54.3,28.9 v52.3,28.9 | v43.3,25.4 42.3,24.39 MODULE2_SENSE.3
A3
  Top 0.254: JP4.3 67.3,66.37 67.3,31.4 70.8,27.9 72.84,27.9 U1.39 U2.39
A4
  Top 0.254: JP4.2 69.14,69.73 66.8,67.4 66.8,30.9 70.3,27.4 73.47,27.4 U1.40 80.3,34.23 80.3,34.66 U2.40
A5
  Top 0.254: JP4.1 66.3,70.45 66.3,30.4 69.8,26.9 74.1,26.9 U1.41 80.8,33.6 80.8,34.45 U2.41
AGND  (via drill 0.4, 0.6)
  Top 0.254: 80.8,30.4 80.8,31.4 81.51,32.1 U1.43 82.08,32.62 82.08,34.32 U2.43 | 80.8,30.4 80.8,29.55 C6.2 | v86.8,23.4 88.3,24.9 94.8,24.9 96.3,26.4 v96.3,29.9 | v81.8,30.15 81.8,30.4 80.8,30.4
  Bottom 0.254: v86.8,23.4 86.8,24.4 85.8,25.4 81.8,25.4 80.3,26.9 80.3,28.65 v81.8,30.15 | v96.3,29.9 96.3,32.4 95.3,33.4 93.8,33.4 93.64,33.23 R10.1
AREF  (via drill 0.6)
  Top 0.254: U1.42 79.05,30.72 C6.1 | v79.8,30.9 79.8,31.47 U1.42 | U1.42 81.43,32.97 81.43,34.37 U2.42
  Bottom 0.254: JP1.3 106.3,22.42 106.3,20.9 105.3,19.9 87.8,19.9 85.8,21.9 85.8,24.4 85.3,24.9 81.3,24.9 79.8,26.4 v79.8,30.9
AVCC  (via drill 0.4, 0.6)
  Top 0.254: 72.3,32.41 L1.2 v73.3,31.9 | v78.3,25.9 79.09,26.68 C5.1 79.98,27.07 81.8,28.9 82.8,28.9 83.3,29.4 83.3,29.9 | v80.8,46.9 80.8,45.6 U1.24 82.1,44.3 82.1,42.65 U2.24 | U2.44 82.8,34.33 82.8,32.21 U1.44 83.3,30.37 83.3,29.9 | 83.3,29.9 v84.9,29.9
  Bottom 0.254: v78.3,25.9 76.8,25.9 75.8,26.9 75.8,29.9 73.8,31.9 v73.3,31.9 | v80.8,46.9 81.3,46.9 87.8,40.4 87.8,31.9 85.8,29.9 v84.9,29.9
BLED  (via drill 0.6)
  Top 0.254: R5.1 19.7,31.3 v18.8,30.4 | v18.3,55.9 18.3,56.4 18.8,56.9 18.83,56.9 R2.1 | TBLUE.P$2 19.82,66.92 v18.8,65.9
  Top 0.406: TBLUE.P$2 21.8,70.18 21.8,72.9 23.3,74.4 27.3,74.4 28.3,73.4 33.3,73.4 33.8,73.9 v39.3,73.9
  Bottom 0.254: v18.8,30.4 18.8,55.4 v18.3,55.9 18.3,65.4 v18.8,65.9
  Bottom 0.406: v39.3,73.9 44.57,79.16 LED_EXP.4
CMP  (via drill 0.4, 0.5)
  Top 0.254: RN1.7 81.3,52.09 81.3,52.45 82.3,52.9 82.3,53.37 RN1.1 | 82.17,53.27 RN1.1 | RN1.1 82.7,53.9 84.3,53.9 84.91,54.5 85.6,54.5 IC2.5 87.3,56.21 v87.3,56.4 | v101.3,53.4 101.8,53.4 102.28,53.88 C22.1
  Bottom 0.254: v87.3,56.4 87.8,56.9 99.8,56.9 101.3,55.4 v101.3,53.4
D0/RX  (via drill 0.4)
  Top 0.254: JP2.8 66.61,25.09 63.8,27.9 63.8,36.4 62.3,37.9 v62.3,38.4 | v77.3,48.4 77.8,48.9 87.3,48.9 88.05,48.15 88.05,46.76 U1.20 85.3,43.76 85.3,42.48 U2.20
  Bottom 0.254: v62.3,38.4 67.3,43.4 67.3,45.15 70.55,48.4 v77.3,48.4
D1/TX  (via drill 0.4)
  Top 0.254: JP2.7 69.15,25.05 68.8,25.4 67.3,25.4 64.3,28.4 v64.3,38.4 | v78.8,47.9 79.3,48.4 87.05,48.4 87.55,47.9 87.55,47.15 U1.21 84.8,44.39 84.8,42.69 U2.21
  Bottom 0.254: v78.8,47.9 78.3,47.9 77.8,47.4 74.8,47.4 74.3,47.9 70.8,47.9 67.8,44.9 67.8,42.9 64.3,39.4 v64.3,38.4
D2/SDA  (via drill 0.4, 0.6)  (1 unrouted)
  Top 0.254: JP1.2 108.78,24.42 108.3,24.9 105.3,24.9 104.8,25.4 104.8,34.9 v103.8,35.9 | v75.3,16.9 84.8,16.9 86.3,18.4 100.8,18.4 101.3,18.9 v103.8,18.9 | 49.8,16.4 74.8,16.4 | v88.3,49.4 88.55,49.15 88.55,45.88 U1.19 85.8,43.13 85.8,42.28 U2.19
  Top 0.305: MODULE2_SENSE.1 v34.8,29.47 37.23,29.47 49.3,16.9 49.8,16.4 | 74.8,16.4 v75.3,16.9
  Top 0.406: v40.3,61.4 36.3,57.4 v34.8,57.4
  Bottom 0.254: v103.8,35.9 102.8,36.9 99.3,36.9 96.8,39.4 96.8,41.9 92.3,46.4 89.3,46.4 88.55,47.15 88.55,49.15 v88.3,49.4 | v103.8,18.9 107.3,18.9 108.8,20.4 108.8,22.4 | 108.52,22.49 JP1.2
  Bottom 0.305: v75.3,16.9 71.69,20.51 JP2.6
  Bottom 0.406: MODULE1_SENSE.1 43.42,64.52 v40.3,61.4 | v34.8,57.4 v34.8,29.47
D3/SCL  (via drill 0.4, 0.6)  (1 unrouted)
  Top 0.254: 48.8,15.9 v76.8,15.9 84.8,15.9 86.8,17.9 v102.3,17.9 | JP1.1 111.3,22.5 111.3,24.9 110.8,25.4 105.8,25.4 105.3,25.9 v105.3,35.9 | v89.55,47.4 89.55,45.74 U1.18 86.3,42.49 86.3,42.07 U2.18
  Top 0.305: MODULE2_SENSE.2 v34.8,26.93 38.27,26.93 48.8,15.9
  Top 0.406: v36.8,61.4 36.8,59.4 35.8,58.4 30.8,58.4 v30.3,57.9
  Bottom 0.254: v105.3,35.9 103.8,37.4 99.8,37.4 97.3,39.9 97.3,42.4 92.3,47.4 v89.55,47.4 | v102.3,17.9 109.3,17.9 111.3,19.9 111.3,22.4 | 111.06,22.49 JP1.1
  Bottom 0.305: v76.8,15.9 76.8,17.9 74.23,20.47 JP2.5
  Bottom 0.406: MODULE1_SENSE.2 42.46,67.06 v36.8,61.4 | v30.3,57.9 30.3,31.43 v34.8,26.93
D4  (via drill 0.4)
  Top 0.254: JP2.4 76.77,20.93 77.3,20.4 79.8,20.4 80.55,21.15 80.55,26.15 81.3,26.9 84.05,26.9 v84.8,27.65 | 81.4,43.9 81.3,43.97 U1.25 81,44.2 | U2.25 81.4,42.65 81.4,43.9 | 81.4,43.9 79.8,45.4 v79.8,45.9
  Bottom 0.254: v79.8,45.9 80.8,45.9 87.3,39.4 87.3,33.9 84.34,31.36 84.09,31.15 84.05,31.11 84.05,28.9 84.8,28.15 v84.8,27.65
D5/RED*  (via drill 0.4)
  Top 0.254: U2.31 79.36,40.4 78.08,40.4 U1.31 76.58,41.9 74.3,41.9 73.3,40.9 73.3,38.9 v69.8,35.4 | v58.8,30.9 27.8,30.9 26.3,32.4 24.3,32.4 v23.8,32.9 | JP2.3 79.31,23.89 78.8,24.4 78.3,24.4 77.3,25.4 v71.3,25.4 | v21.8,65.4 19.8,65.4 19.3,64.9 16.8,64.9 15.3,66.4 15.3,71.9 16.56,73.15 TRED.P$1
  Bottom 0.254: v58.8,30.9 59.8,30.9 60.8,31.9 60.8,33.9 61.8,34.9 69.3,34.9 v69.8,35.4 69.8,34.4 70.8,33.4 70.8,25.9 v71.3,25.4 | v23.8,32.9 23.8,36.9 22.3,38.9 22.3,64.9 v21.8,65.4
D6/GREEN*  (via drill 0.4)
  Top 0.254: U2.27 80.3,42.28 80.3,42.7 U1.27 77.11,45.9 73.3,45.9 72.8,45.4 72.8,43.9 v69.8,40.9 | v59.3,34.4 59.3,33.9 57.3,31.9 38.3,31.9 33.8,36.4 v26.3,36.4 | v20.8,70.9 20.8,73.4 22.8,75.4 22.8,77.4 22.3,77.9 18.5,77.9 TGREEN.P$1
  Bottom 0.254: v59.3,34.4 61.3,36.4 64.8,36.4 69.3,40.9 v69.8,40.9 69.8,39.4 70.8,38.4 70.8,34.9 71.8,33.9 71.8,28.9 76.3,24.4 77.8,24.4 78.05,24.15 78.05,20.65 78.55,20.4 81.3,20.4 81.85,20.95 JP2.2 | v26.3,36.4 22.8,39.9 22.8,65.9 21.8,66.9 21.8,69.9 v20.8,70.9
D7/MODULE1  (via drill 0.4)
  Top 0.254: MODULE1_SENSE.4 55.4,74.9 76.8,74.9 77.8,73.9 77.8,68.9 76.8,67.9 71.8,67.9 68.8,64.9 68.8,44.4 v69.8,43.4 | JP2.1 87.3,25.4 87.3,26.9 86.3,27.9 86.3,29.4 85.8,29.9 85.8,30.42 U1.1 84.3,31.92 84.3,34.04 U2.1
  Bottom 0.254: JP2.1 84.39,24.4 80.3,24.4 79.8,24.9 76.8,24.9 72.3,29.4 72.3,34.4 71.3,35.4 71.3,36.4 71.8,36.9 71.8,38.4 70.8,39.4 70.8,42.4 v69.8,43.4
D9/BLUE*  (via drill 0.4)
  Top 0.254: 78.74,41.96 U1.29 | U2.29 79.77,41.4 79.3,41.4 78.8,41.94 U1.29 | U1.29 76.85,43.9 v75.55,43.9 73.8,43.9 73.3,43.4 73.3,41.9 72.8,41.4 72.8,39.9 v69.8,36.9 | v59.3,32.4 58.8,31.9 58.3,31.9 57.8,31.4 37.3,31.4 34.3,34.4 v21.8,34.4 | v20.3,69.9 18.57,69.9 TBLUE.P$1
  Bottom 0.254: v59.3,32.4 59.8,32.4 60.3,32.9 60.3,34.4 61.3,35.4 68.3,35.4 v69.8,36.9 | JP1.9 91,24.2 88.8,26.4 83.8,26.4 83.05,27.15 83.05,34.65 75.3,42.4 75.3,43.65 v75.55,43.9 | v21.8,34.4 21.8,63.9 20.8,64.9 20.8,69.4 v20.3,69.9
D+  (via drill 0.4)
  Top 0.254: RN3.8 90.57,31.09 Z1.1 91.33,29.43 89.3,27.4 89.3,26.9 89.8,26.4 91.3,26.4 92.3,27.4 93.8,27.4 v94.8,28.4
  Bottom 0.254: J1.P$3 119.03,28.67 119.3,28.4 119.3,25.4 118.3,24.4 114.3,24.4 112.8,25.9 112.3,25.9 109.3,28.9 95.3,28.9 v94.8,28.4
D-  (via drill 0.4)
  Top 0.254: RN3.5 88.64,29.02 Z2.1 88.3,27.8 88.3,26.9 89.3,25.9 91.8,25.9 92.3,26.4 94.3,26.4 v95.3,27.4 | v112.8,24.4 117.8,24.4 118.3,24.9 v118.3,27.4
  Bottom 0.254: v118.3,27.4 117.68,28.02 J1.P$2 | v112.8,24.4 108.8,28.4 96.3,28.4 v95.3,27.4
GATE_CMD
  Top 0.254: IC2.7 87.87,54.94 T1.3
GLED  (via drill 0.6)
  Top 0.254: R6.1 19.77,34.37 v20.8,35.4 | v20.8,59.9 19.91,59.9 R3.1 | TGREEN.P$2 19.3,75.75 19.3,74.4 18.8,73.9 18.8,70.9 17.8,69.9 16.8,69.9 16.3,69.4 v16.3,68.9
  Top 0.406: TGREEN.P$2 21.5,76.2 v21.8,75.9
  Bottom 0.254: v20.8,35.4 v20.8,59.9 20.8,63.9 19.8,64.9 19.8,66.9 18.3,68.4 16.8,68.4 v16.3,68.9
  Bottom 0.406: v21.8,75.9 23.3,74.4 27.3,74.4 27.8,73.9 33.8,73.9 39.76,79.86 LED_EXP.2
GND  (via drill 0.6)  (1 unrouted)
  Top 0.254: U4.SGND 50.28,39.92 v49.8,40.4 | C5.2 77.74,28.33 v76.8,27.4 75.8,26.4 68.8,26.4 v68.3,26.9 | v75.3,35.4 75.81,35.4 U1.35 77.81,37.4 78.3,37.4 78.66,37.05 79.16,37.05 U2.35 80.01,37.9 80.03,37.9 80.53,38.4 81.3,38.4 81.37,38.47 U2.EXP 83.89,38.95 85.3,38.95 86.3,39.95 U2.15 87.25,40.9 88.1,40.9 U1.15 90.6,43.4 v90.8,43.4 | ICSP.6 106.08,45.9 103.25,45.9 C3.1 | 89.5,58.4 90,58.9 92.3,58.9 92.8,58.4 | C9.2 109.8,33.71 v109.8,35.4 | 10.73,65.67 11.02,65.67 | 82.85,42.55 83.3,42.1 83.3,39.9 | 82.8,42.6 82.85,42.55 | 82.85,42.55 U2.23 82.86,44.67 U1.23
  Top 0.305: RN1.3 80.57,55.63 79.3,56.9 78.48,56.9 CP1.- 76.85,58.1 v76.8,58.15 | C13.2 88.3,63.69 v88.3,63.4 | IC2.4 89.5,58.4 | 92.8,58.4 v93.3,57.9
  Top 0.406: C13.2 88.34,63.65 C14.2 86.56,59.74 C11.2 86.03,58.17 v86.3,57.9 | RN1.3 RN1.2 | C1.2 C2.2 C15.2 102.82,56.14 C22.2 | C22.2 100.55,56.14 100.05,55.64 U3.2 100.56,55.64 100.8,55.4 100.8,54.4 97.78,51.37 | C22.2 102.28,57.9 IC1.1 | R9.1 43.1,44.76 C10.2 44.86,44.34 45.8,43.4 45.8,40.4 v46.3,39.9 | U4.GND1 U4.GND2 U4.NC5 | U4.NC4 U4.NC3 U4.NC2 U4.NC1 54.8,36.34 v54.8,35.9 | U4.GND1 54.25,41.35 v55.3,42.4 | U4.GND1 U4.GND | CP2.- 116.12,74.58 v117.3,73.4 | U4.NC 56.58,38.62 v56.8,38.4 | RN2.4 59.3,24.57 v59.3,26.9 | 97.78,51.37 96.64,52.51 C4.1 95.69,52.51 94.3,53.9 94.3,56.9 v93.3,57.9 | 97.78,51.37 C3.1 | Z2.2 91.44,27.61 Z1.2 93.3,28.91 L2.1 96.01,31.63 C8.- 96.01,31.61 v95.3,30.9 | v103.3,32.4 103.3,26.9 103.7,26.5 JP1.4 | U2.EXP 83.3,38.47 83.3,39.9
  Top 0.61: TGREEN.P$3 16.66,75.25 v16.3,74.9 | TRED.P$3 16.66,71.25 v16.3,70.9 | TBLUE.P$3 16.45,67.25 v16.3,67.4
  Top 0.813: RST1.A 11.02,65.67 RST1.B | IR_CONNECT.P$1 24.3,49.8 v24.3,52.4
  Bottom 0.254: v76.8,27.4 76.8,29.9 73.8,32.9 73.8,33.9 v75.3,35.4 | R10.2 91.8,33.62 91.8,32.9 92.3,32.4 93.3,32.4 93.69,32.78 R11.1 | 12,65.67 12,65.4 | 93.28,57.9 93.28,58.05 v93.3,57.9 | 11.02,65.4 11.02,64.93 v11.05,64.9
  Bottom 0.305: v88.3,63.4 85.18,60.27 78.93,60.27
  Bottom 0.406: JP3.7 JP3.6 | v55.3,42.4 57.3,42.4 | 57.3,42.4 59.45,42.4 2PIN_CONN.PIN2 | PWR_JACK.P$2 119.64,69.06 118.3,70.4 118.3,72.4 v117.3,73.4 116.3,74.4 116.3,75.4 111.3,80.4 105.75,80.4 PWR_EXP.1 | v49.8,40.4 46.8,40.4 v46.3,39.9 46.55,39.65 46.55,37.15 48.8,34.9 53.8,34.9 v54.8,35.9 54.8,36.4 v56.8,38.4 57.3,38.9 57.3,42.4 | MODULE2_PWR.3 54.26,21.85 v59.3,26.9 v68.3,26.9 | JP1.4 103.7,26.5 102.8,27.4 96.8,27.4 95.8,26.4 94.8,26.4 93.8,27.4 93.8,29.57 94.13,29.9 v95.3,30.9 95.3,31.18 R11.1 | 77.3,49.9 82.8,49.9 84.8,48.4 84.8,46.9 87.3,44.4 89.8,44.4 v90.8,43.4 | v109.8,35.4 107.3,32.9 103.8,32.9 v103.3,32.4 | 92.33,34.37 R10.2
  Bottom 0.61: PWR_JACK.P$2 119.54,66.24 PWR_JACK.P$3 | 92.33,34.37 94.8,36.84 94.8,40.4 91.8,43.4 v90.8,43.4 | v16.3,74.9 v16.3,70.9 19.3,70.9 20.5,72.1
  Bottom 0.813: RST1.A 11.02,65.4 | 11.02,65.4 RST1.B | JP3.7 87.02,68.36 82.18,63.52 | 82.18,63.52 78.93,60.27 v76.8,58.15 | 76.3,57.65 76.3,50.9 77.3,49.9 | 76.3,57.65 v76.8,58.15 | 82.18,63.52 82.18,73.02 78.8,76.4 49.3,76.4 39.9,67 34.2,67 | v24.3,52.4 24.3,57.1 34.2,67 | 20.5,72.1 MODULE1_PWR.3 29.1,72.1 34.2,67 | 11.02,65.4 12,65.4 13.8,65.4 14.3,65.9 14.3,66.9 | PWR_JACK.P$3 110.55,63.64 104.8,57.9 v93.3,57.9 | 78.05,59.4 v76.8,58.15 | 93.28,57.9 v93.3,57.9 | v93.3,57.9 77.05,57.9 v76.8,58.15 | 76.3,57.65 76.05,57.4 75.3,57.4 72.3,54.4 69.8,54.4 68.8,53.4 68.8,50.9 63.8,45.9 62.95,45.9 2PIN_CONN.PIN2 | 14.3,66.9 14.3,69.9 15.3,70.9 v16.3,70.9 | v16.3,67.4 15.8,66.9 14.3,66.9
  other vias: 83.41,38.47
  pour Bottom (isolate 0.406, rank 6): 20.8,94.4 33.8,86.4 44.8,81.9 56.8,79.9 68.8,79.4 80.8,80.9 94.3,84.9 102.8,89.4 106.3,91.4 113.3,83.4 118.3,75.9 122.3,66.4 123.8,59.4 124.3,53.4 121.8,55.4 115.8,55.9 111.8,53.9 108.8,48.4 109.8,43.4 112.8,38.9 118.3,37.4 122.3,38.4 124.8,40.4 122.8,29.9 118.3,17.9 112.3,9.4 108.3,4.9 105.8,2.4 99.8,5.9 90.3,9.9 80.3,12.9 68.8,14.4 57.8,13.9 48.8,12.9 38.8,9.4 26.8,3.9 21.3,0.4 18.3,1.4 14.3,5.4 10.8,9.9 6.8,16.4 2.8,25.4 0.3,35.4 -0.2,40.4 3.3,37.9 7.3,37.9 10.8,38.9 13.3,41.4 15.3,44.9 15.3,49.4 12.8,53.4 9.3,55.4 4.8,56.4 1.8,54.9 -0.2,53.9 0.8,59.9 2.8,68.4 5.8,75.4 10.8,83.9 15.3,89.4
HEATSINK1
  Bottom 0.406: 19.3,89.9 20.3,90.9 21.3,90.9 22.3,89.9
  Bottom 0.61: 22.3,89.9 23.8,89.9 | 20.8,88.4 20.8,86.9 | 19.3,89.9 17.8,89.9
  pour Bottom (rank 4): 20.3,92.4 14.8,88.9 13.3,86.9 13.3,86.4 12.8,85.4 26.8,85.4 28.3,83.9 32.8,83.9 34.8,81.9 34.8,83.9 38.8,84.4
HEATSINK2
  Bottom 0.61: 9.8,76.4 9.8,77.9 | 7.3,75.4 8.8,75.4 9.8,74.4 9.8,72.9 | 10.8,75.4 12.3,75.4
  pour Bottom (rank 4): 10.3,84.9 22.8,84.9 13.8,75.9 13.8,69.9 2.8,69.9
HEATSINK3
  Bottom 0.61: 3.3,58.4 5.3,58.4 5.3,59.4 5.8,59.9 | 5.8,59.9 5.8,60.4 | 8.8,59.4 7.8,59.4 7.3,59.9 5.8,59.9 | 7.8,57.9 8.8,57.9
  pour Bottom (rank 4): 17.3,54.9 1.3,54.9 1.8,60.9 12.8,60.9 15.8,63.9 17.3,63.9
HEATSINK4
  Bottom 0.61: 7.8,35.4 9.3,35.4 | 5.3,32.9 5.3,33.9 4.8,34.4 4.8,35.4 3.8,35.4 | 6.8,33.9 6.8,32.4
  pour Bottom (isolate 0.406, rank 4): 0.3,39.4 4.8,37.4 8.3,37.4 11.8,38.9 16.8,38.9 16.8,28.4 2.3,28.4 1.3,32.9
HEATSINK5
  Bottom 0.61: 7.3,18.9 8.8,18.9 8.8,18.4 9.8,17.4 9.8,15.9 | 9.8,20.4 9.8,21.4 | 11.3,18.9 12.3,18.9
  pour Bottom (isolate 0.406, rank 4): 3.3,27.4 6.3,20.9 10.8,12.4 18.8,12.4 18.8,27.4
HEATSINK6
  Bottom 0.61: 20.8,6.9 20.8,5.4 20.3,4.9 20.3,4.4 18.3,4.4 | 21.8,4.4 23.8,4.4
  pour Bottom (isolate 0.406, rank 4): 10.8,11.4 13.8,7.4 17.3,2.9 20.3,2.4 23.8,2.4 28.3,4.9 34.8,8.4 37.3,9.4 35.3,12.9 32.8,10.4 29.3,9.9 26.8,11.4
HWB  (via drill 0.4)
  Top 0.254: v70.3,52.9 70.3,46.9 71.8,45.4 71.8,43.9 70.3,42.4 69.3,42.4 68.8,41.9 68.8,34.9 69.3,34.4 70.3,34.4 71.3,35.4 71.3,36.15 74.8,39.65 76.39,39.65 U1.33 76.82,39.35 78.98,39.35 U2.33 | v74.8,52.9 76.3,51.4 v77.8,51.4 | v80.8,50.9 80.57,51.13 RN1.6
  Bottom 0.254: v70.3,52.9 v74.8,52.9 | v77.8,51.4 78.3,50.9 v80.8,50.9
IO8/MODULE2  (via drill 0.4)
  Top 0.254: JP1.10 87.39,22.49 83.76,18.95 65.85,18.95 65.3,18.9 63.3,18.9 62.8,19.4 48.8,19.4 v47.8,20.4 | v43.3,19.4 40.85,21.85 MODULE2_SENSE.4 | U1.28 U2.28 76.98,44.9 v74.8,44.9
  Bottom 0.254: v47.8,20.4 44.3,20.4 v43.3,19.4 | v74.8,44.9 74.3,44.4 74.3,42.4 82.55,34.15 82.55,26.65 83.3,25.9 87.3,25.9 88.46,24.74 JP1.10
IO10*  (via drill 0.4)
  Top 0.254: 78.8,40.9 78.71,40.9 U1.30 | U2.30 79.56,40.9 78.8,40.9 | 78.8,40.9 76.8,42.9 v76.3,42.9
  Bottom 0.254: JP1.8 93.54,24.66 93.3,24.9 91.3,24.9 89.3,26.9 84.3,26.9 83.8,27.4 83.8,28.15 83.55,28.4 83.55,35.65 v76.3,42.9
IO11/TSK*  (via drill 0.4)
  Top 0.254: U4.DIS 49.67,39.27 49.3,38.9 47.8,38.9 46.05,37.15 v45.55,37.15 | v98.8,31.4 97.3,29.9 97.3,25.4 96.08,24.17 JP1.7 96.08,20.67 94.8,19.4 86.3,19.4 84.8,17.9 74.8,17.9 74.3,17.4 v70.3,17.4 | U2.12 89.61,39.02 U1.12 91.49,40.9 92.8,40.9 93.3,40.4 103.3,40.4 v104.8,38.9 | v58.8,39.4 62.3,35.9 v62.3,33.9
  Bottom 0.254: v45.55,37.15 48.8,33.9 53.8,33.9 54.8,34.9 55.3,34.9 55.8,35.4 55.8,35.9 57.8,37.9 57.8,38.4 v58.8,39.4 | v104.8,38.9 106.3,37.4 106.3,35.4 104.8,33.9 101.3,33.9 v98.8,31.4 | v70.3,17.4 70.3,32.9 69.3,33.9 v62.3,33.9
IO12  (via drill 0.4)
  Top 0.254: 80.8,43.34 80.8,42.49 U2.26 | 80.8,43.34 U1.26 | 80.8,43.34 80.8,43.4 v77.8,46.4
  Bottom 0.254: v77.8,46.4 78.3,46.9 79.3,46.9 80.8,48.4 83.3,48.4 83.8,47.9 83.8,46.9 84.8,45.9 84.8,45.4 92.8,37.4 92.8,36.9 90.8,34.9 90.8,32.9 92.8,30.9 92.8,26.4 93.3,25.9 94.3,25.9 94.8,25.4 98.12,25.4 98.62,24.9 JP1.6
IO13*  (via drill 0.4)
  Top 0.254: JP1.5 101.16,27.75 102.3,28.9 102.3,31.4 99.3,34.4 v99.3,34.9 | U2.32 79.15,39.9 77.45,39.9 U1.32 76.45,40.9 74.8,40.9 v74.3,40.4 | v86.55,47.4 86.05,47.9 80.3,47.9 79.3,46.9 78.55,46.9 78.05,47.4 74.8,47.4 74.3,46.9 v73.8,46.9
  Bottom 0.254: v99.3,34.9 99.3,35.9 96.3,38.9 96.3,41.4 91.8,45.9 88.3,45.9 86.8,47.4 v86.55,47.4 | v73.8,46.9 73.8,44.9 73.3,44.4 73.3,41.4 v74.3,40.4
MISO  (via drill 0.4)
  Top 0.254: U2.11 89.61,37.92 U1.11 90.72,37.2 93.05,39.53 99.43,39.53 v99.8,39.4
  Bottom 0.254: ICSP.1 100.8,45.91 100.8,40.4 v99.8,39.4
MOSI  (via drill 0.4)
  Top 0.254: U2.10 87.71,37 89.5,37 U1.10 90.5,35.9 90.8,35.9 91.3,36.4 91.3,36.9 92.8,38.4 100.3,38.4 v100.8,38.9
  Bottom 0.254: ICSP.4 105.87,45.9 103.8,45.9 102.8,44.9 102.8,38.9 102.3,38.4 101.3,38.4 v100.8,38.9
N$2
  Bottom 0.406: 7.3,61.9 7.3,67.9
N$5
  Top 0.254: R8.1 46.63,38.73 49.3,41.4 50.8,41.4 51.8,42.4 51.8,43.9 52.3,44.4 55.3,44.4 56.8,42.9 56.8,39.9 56.17,39.27 U4.TON
N$8  (via drill 0.4)
  Top 0.254: U4.ISEN 52.3,41.9 v53.3,42.9
  Top 0.305: R9.2 41.4,46 v40.8,45.4
  Top 0.406: D3.A 44.85,34.9 v43.3,34.9
  Bottom 0.254: v40.8,45.4 42.3,43.9 52.3,43.9
  Bottom 0.305: 52.3,43.9 v53.3,42.9
  Bottom 0.406: v43.3,34.9 40.8,37.4 v40.8,45.4
N$9  (via drill 0.4)
  Top 0.254: C12.1 50.8,44.43 v50.8,42.9 | v49.3,37.9 50.02,38.62 U4.BOOT
  Bottom 0.254: v50.8,42.9 52.3,41.4 52.3,36.4 51.8,35.9 49.8,35.9 49.3,36.4 v49.3,37.9
N$10  (via drill 0.4)
  Top 0.254: C12.2 45.92,45.78 v49.3,42.4
  Top 0.305: 45.92,49.13 C12.2 45.92,49.02 47.3,50.4 50.13,50.4 I_LEDDRIVER.P$1
  Top 0.406: U4.LX 51.23,36.97 v51.3,36.9 51.25,36.9 D3.C
  Bottom 0.254: v49.3,42.4 51.3,40.4 v51.3,36.9
N$11  (via drill 0.4)
  Top 0.254: RN2.7 61.49,22.21 61.8,21.9 62.3,21.9 v64.3,19.9
  Bottom 0.254: v64.3,19.9 66.24,19.9 TX.C
N$12  (via drill 0.4)
  Top 0.254: RN2.6 60.69,22.01 v62.3,20.4
  Bottom 0.254: v62.3,20.4 62.3,19.43 RX.C
N$13  (via drill 0.4)
  Top 0.254: RN2.5 59.89,22.49 v57.8,20.4
  Bottom 0.254: v57.8,20.4 57.8,19.6 ON.C
N$14
  Top 0.305: R2.2 14.18,57.77 13.75,57.35 RGB3.P$1
N$15
  Top 0.813: I_LEDDRIVER.P$2 60.29,50.56 2PIN_CONN.PIN1
N$16
  Top 0.305: R3.2 13.6,59.69 12.3,58.4 RGB3.P$2
N$17
  Top 0.305: R4.2 13.64,61.73 11.35,59.45 RGB3.P$3
N$18
  Top 0.254: RGB2.P$1 8.73,72.83 8.3,72.4 7.3,72.4 4.8,69.9 4.8,68.4 4.3,67.9 4.3,63.4 2.8,61.9 2.8,57.9 3.35,57.35 RGB3.P$6
N$19
  Top 0.254: RGB2.P$2 9.78,71.88 9.3,71.4 7.3,71.4 5.3,69.4 5.3,67.9 4.8,67.4 4.8,62.9 3.3,61.4 3.3,58.9 3.8,58.4 RGB3.P$5
N$20
  Top 0.254: RGB2.P$3 10.83,71.43 9.8,70.4 7.3,70.4 5.8,68.9 5.8,67.4 5.3,66.9 5.3,60.08 RGB3.P$4
N$21
  Top 0.305: R5.2 16.25,32.45 14.35,34.35 RGB6.P$1
N$22
  Top 0.305: R6.2 16.33,34.37 15.3,35.4 RGB6.P$2
N$23
  Top 0.305: 17.67,36.74 R7.2 17.96,36.45 RGB6.P$3
N$24
  Top 0.305: RGB5.P$1 10.83,28.47 4.96,34.35 RGB6.P$6
N$25
  Top 0.305: RGB5.P$2 9.78,27.42 3.3,33.9 3.3,34.9 3.8,35.4 RGB6.P$5
N$26
  Top 0.305: RGB5.P$3 8.73,26.97 2.3,33.4 2.3,35.9 2.8,36.4 4.62,36.4 RGB6.P$4
N$27
  Top 0.305: RGB5.P$4 8.73,15.97 10.3,14.4 12.8,14.4 19.75,7.45 RGB4.P$3
N$28
  Top 0.305: RGB5.P$5 9.78,16.42 10.8,15.4 13.3,15.4 20.8,7.9 RGB4.P$2
N$29
  Top 0.305: RGB5.P$6 12.91,17.29 21.85,8.35 RGB4.P$1
N$30
  Top 0.406: RGB1.P$3 21.85,86.94 11.91,77.01 RGB2.P$4
N$31
  Top 0.406: RGB1.P$2 20.8,87.39 11.8,78.4 10.3,78.4 9.78,77.88 RGB2.P$5
N$32
  Top 0.406: RGB2.P$6 8.73,77.83 10.3,79.4 11.05,79.4 RGB1.P$1
PWRIN
  Top 0.813: D1.A 111.82,66.87 PWR_JACK.P$1
  Bottom 0.813: PWR_JACK.P$1 114.14,74.56 112.3,76.4 103.3,76.4 100.8,78.9 100.8,83.9 101.8,84.9 104.75,84.9 PWR_EXP.2
RD+
  Top 0.254: RN3.1 88.65,32.4 87.21,32.4 U1.4 85.8,33.81 85.8,34.66 U2.4
RD-
  Top 0.254: RN3.4 87.31,30.39 87.05,30.65 87.05,31.43 U1.3 85.3,33.18 85.3,34.45 U2.3
RESET  (via drill 0.4, 0.6)  (2 unrouted)
  Top 0.254: v93.3,68.4 93.3,67.4 91.55,65.65 D2.A 92.8,65.35 v92.8,65.4 | v72.3,56.9 72.3,51.9 73.8,50.4 78.3,50.4 78.8,50.9 78.8,52.4 RN1.4 79.25,53.9 v78.8,53.9 | v32.8,60.4 28.8,60.4 24.8,64.4 14.8,64.4 13.3,65.9 13.3,68.4 11.8,69.9 10.3,69.9 9.8,69.4 7.8,69.4 7.3,68.9 7.3,67.41 7.32,67.4 7.32,64.91 v7.3,64.9 | v108.3,63.9 108.8,63.4 v108.8,52.4 | U2.13 87.67,39.9 89.36,39.9 U1.13 90.86,41.4 93.3,41.4 93.8,40.9 100.87,40.9 ICSP.5 102.3,44.73 v99.8,47.23
  Top 0.406: RST1.H 7.32,67.4 RST1.D
  Bottom 0.254: v32.8,60.4 33.8,59.4 64.3,59.4 | 99.8,51.9 99.8,53.9 97.8,55.9 94.3,55.9 93.8,55.4 86.8,55.4 86.3,55.9 86.3,56.4 85.8,56.9 79.8,56.9 78.55,55.65 78.55,54.15 v78.8,53.9 | 99.8,51.9 v99.8,47.23 | v92.8,65.4 93.3,65.9 105.8,65.9 107.8,63.9 v108.3,63.9 | v108.8,52.4 108.3,51.9 99.8,51.9
  Bottom 0.305: JP3.3 97.18,68.77 96.8,68.4 v93.3,68.4
  Bottom 0.406: 64.3,59.4 69.8,59.4 v72.3,56.9
RLED  (via drill 0.6)
  Top 0.254: R4.1 19.8,61.83 v19.8,63.4 24.3,63.4 v24.8,62.9 | v19.8,38.4 19.8,36.51 R7.1 | v34.8,72.4 32.3,72.4 v29.3,69.4 | TRED.P$2 19.81,73.91 v20.3,74.4
  Bottom 0.254: v19.8,38.4 19.8,55.9 18.8,56.9 18.8,62.4 v19.8,63.4 | LED_EXP.3 42.17,79.76 v34.8,72.4 34.3,72.9 27.8,72.9 27.3,73.4 21.8,73.4 20.8,74.4 v20.3,74.4 | v29.3,69.4 24.8,64.9 v24.8,62.9
RXLED  (via drill 0.4)
  Top 0.254: v94.8,20.9 94.3,20.4 86.3,20.4 84.3,18.4 v60.3,18.4 | v60.8,25.4 60.69,25.29 RN2.3 | 88.24,35.9 87.39,35.9 U2.8 | 88.24,35.9 U1.8 | 88.24,35.9 88.3,35.9 89.5,34.7 v89.55,34.7
  Bottom 0.254: v94.8,20.9 94.8,24.4 93.8,25.4 92.3,25.4 92.13,25.58 92.13,30.68 89.55,33.25 v89.55,34.7 | v60.3,18.4 59.8,18.9 59.8,24.9 60.3,25.4 v60.8,25.4
SCK  (via drill 0.4)
  Top 0.254: U2.9 87.6,36.45 88.87,36.45 U1.9 89.87,35.4 91.3,35.4 93.8,37.9 101.3,37.9 101.8,38.4 v101.8,39.4
  Bottom 0.254: ICSP.3 104.18,47.27 101.8,44.9 v101.8,39.4
SQUISH  (via drill 0.4, 0.6)
  Top 0.254: v70.8,44.4 69.3,45.9 69.3,56.9 v69.8,57.4 | IR_CONNECT.P$2 25.91,47.01 | v72.3,35.9 72.3,34.4 73.8,32.9 74.44,32.9 U1.36 77.94,36.5 79.32,36.5 U2.36
  Top 0.406: JP4.6 79.3,66.89 78.8,66.4 73.3,66.4 71.3,64.4 71.3,62.4 69.8,60.9 v69.8,57.4 | 25.91,47.01 34.8,55.9 36.8,55.9 42.3,61.4 60.8,61.4 63.3,58.9 v63.3,57.4
  Bottom 0.254: v70.8,44.4 71.3,43.9 71.3,39.9 72.3,38.9 v72.3,35.9
  Bottom 0.406: v63.3,57.4 v69.8,57.4
TXLED  (via drill 0.4)
  Top 0.254: RN2.2 61.49,24.59 62.3,25.4 63.3,25.4 64.8,23.9 64.8,20.9 65.8,19.9 82.3,19.9 83.05,20.65 83.05,24.15 83.3,24.4 85.3,24.4 86.8,25.9 86.8,26.4 85.8,27.4 85.8,28.4 v85.3,28.9 | 84.3,44.9 84.3,45.02 U1.22 | U2.22 84.3,42.9 84.3,44.9 | 84.3,44.9 84.8,45.4 83.3,46.9 v82.8,46.9
  Bottom 0.254: v82.8,46.9 82.8,46.4 88.3,40.9 88.3,31.4 85.8,28.9 v85.3,28.9
UCAP
  Top 0.254: U2.6 U1.6 88.48,33.4 90.8,33.4 91.18,33.77 C7.1
UGND  (via drill 0.6)
  Top 0.254: v100.8,29.9 100.8,30.9 96.8,34.9 95.8,34.9 92.97,32.06 L2.2 92.15,32.51 C7.2 90.7,32.9 87.85,32.9 U1.5 86.35,34.4 86.3,34.4 86.3,34.87 U2.5
  Bottom 0.254: 115.82,29.9 J1.P$5 115.23,29.97 114.8,30.4 113.3,30.4 112.8,29.9 v100.8,29.9
  Bottom 0.406: R11.2 93.48,34.4 95.3,34.4 97.3,32.4 97.3,30.9 98.3,29.9 v100.8,29.9
VIN  (via drill 0.6)
  Top 0.406: RN1.8 82.3,51.9 83.3,51.9 83.3,52.4 v83.8,52.9 | C10.1 42.62,40.64 R8.2 37.63,38.73 36.3,37.4 36.3,35.4 38.8,32.9 55.8,32.9 v56.3,33.4 56.3,37.4 55.73,37.97 U4.VIN | RGB1.P$6 RGB1.P$5 RGB1.P$4 | RGB4.P$4 RGB4.P$5 RGB4.P$6 26.81,5.9 32.3,9.4 38.8,15.9 v40.3,15.9 | 82.61,68.88 82.8,68.69 82.8,64.9 73.3,64.9 72.3,63.9 72.3,58.9 73.3,57.9 73.3,52.4 v74.3,51.4
  Top 0.61: CP1.+ 83.81,56.9 v83.8,54.9
  Top 0.813: JP3.8 82.61,68.88 CP1.+ | 88.83,66.9 v88.3,66.9 87.3,66.9 84.48,69.72 JP3.8 | JP3.8 78.83,76.4 37.8,76.4 37.36,76.84 LED_EXP.1 37.22,82.4 34.8,82.4 33.05,84.15 32.06,84.15 RGB1.P$4 | D1.C 100.83,66.87 | 100.83,66.87 v100.8,66.9 | 100.83,66.87 100.83,64.17 IC1.3
  Bottom 0.254: 56.8,35.9 56.8,34.4 56.3,33.9 v56.3,33.4
  Bottom 0.406: v40.3,15.9 40.3,18.9 51.3,29.9 52.8,29.9 v56.3,33.4 | v74.3,51.4 70.8,51.4 65.3,45.9 65.3,44.9 59.8,39.4 59.8,38.9 56.8,35.9
  Bottom 0.61: v83.8,54.9 v83.8,52.9
  Bottom 0.813: v88.3,66.9 v100.8,66.9
  pour Top (isolate 0.406): 14.8,3.4 20.8,-2.6 27.3,2.4 38.8,7.9 44.8,9.9 40.3,17.4 32.3,9.4 22.3,3.9 14.8,3.9
  pour Top (isolate 0.406): 22.8,88.9 13.8,88.9 20.3,95.4 27.8,90.4 42.3,84.4 55.8,80.9 68.8,80.4 78.3,81.4 85.8,72.4 85.8,69.4 88.3,67.9 90.3,67.9 90.3,65.9 83.8,65.9 84.3,54.4 81.3,54.4 81.3,72.4 78.3,75.4 45.3,77.9 27.8,84.9
  pour Top (isolate 0.406): 35.8,42.4 44.8,42.4 44.8,40.4 43.3,40.4 43.3,32.4 38.8,32.4 35.8,35.4
  pour Top (isolate 0.406): 53.8,37.9 57.3,37.9 57.3,33.4 56.3,32.4 43.3,32.4 43.3,33.4 53.3,33.4 53.8,33.9
  pour Top (isolate 0.406): 58.8,76.4 37.8,76.4 37.3,76.9 37.3,83.9 58.3,77.9
VUSB  (via drill 0.4)
  Top 0.254: F1.1 107.04,30.4 | 107.15,31.4 F1.1 | 106.84,29.53 F1.1 | C9.1 108.01,35.69 106.8,36.9 v96.3,36.9 95.72,36.9 C8.+ 91.97,35.07 91.3,34.4 90.8,34.4 90.3,33.9 89.11,33.9 U1.7 87.61,35.4 87.18,35.4 U2.7 | v93.8,52.9 93.8,53.4 93.3,53.9 93.3,55.45 T1.1
  Top 0.406: 106.84,29.53 106.84,32.53 C9.1
  Bottom 0.254: v96.3,36.9 95.8,37.4 95.8,40.9 91.3,45.4 87.3,45.4 85.55,47.4 85.55,49.65 88.8,52.9 v93.8,52.9
  pour Top (isolate 0.406, rank 3): 93.8,33.4 95.8,35.4 103.8,35.4 104.3,34.9 104.3,25.4 104.8,24.9 108.8,24.9 108.8,36.4 108.3,36.9 94.8,36.9 92.3,34.9
XTAL1
  Top 0.254: X1.1 93.92,51.25 C4.2 | X1.1 92.08,47.05 R1.1 90.17,45.23 U1.17 U2.17 | X1.1 X1.P$1
XTAL2
  Top 0.254: X1.2 97.33,47.84 C3.2 | X1.2 93.54,46 R1.2 90.46,44.39 U1.16 87.47,41.4 87.04,41.4 U2.16 | X1.2 X1.P$2
XUSB  (via drill 0.4)
  Top 0.254: F1.2 110.74,27.7 112.55,25.9
  Top 0.305: 112.55,25.9 v114.3,25.9
  Bottom 0.305: v114.3,25.9 115.78,27.37 J1.P$1

### Text on the board
Top: Top
Bottom: Bottom
tPlace: + | + | - | - | + | GND | - | +
tStop: Top Solder Stop Mask
bStop: Bottom Solder Stop Mask
tCream: Top Paste Mask
tDesignators: RGB1 | PWR_EXP | CP2 | TGREEN | JP4 | JP3 | RGB2 | TRED | D1 | TBLUE | RST | MODULE1_PWR | C13 | D2 | IC1 | MODULE1_SENSE | C11 | C14 | C1 | CP1 | R4 | C2 | R3 | C15 | RGB3 | R2 | IC2 | T1 | I_LEDDRIVER | U3 | C22 | C4 | RN1 | R9 | C12 | C3 | U1, U2 | R1 | IR_CONNECT | C10 | X1 | R8 | R7 | + | U4 | C8 | C9 | RGB4 | R6 | L1 | C7 | - | R5 | D3 | C6 | C5 | RN3 | L2 | Z1 | F1 | Z2 | RGB5 | MODULE2_SENSE | MODULE2_PWR | RN2 | JP2 | JP1 | RGB6 | Top Designators
bDesignators: PWR_JACK | RST1 | 2PIN_CONN | J1 | ON | RX | TX | Bottom Designators
tSilkscreen: VIN | Alt Pwr | G | LED Ext | R | B | Module 2 | Module 1 | Eye | Digital to 7 | GND | +3V3 | Module 1 | Analog to A1 | +5V | SCL | A5 | A4 | A3 | A2 | A1 | A0 | VIN | GND | GND | +5V | +5V | Reset | +3V3 | SDA | RESET | Eye | ICSP | MISO | 5V | Task Light | SCK | MOSI | Clyde | Version 1.0.0 Batch 1 | RST | GND | SDA | SCL | +5V | USB | 0 | 1 | 2 | 3~ | 4 | 5~ | 6~ | 7 | 8 | 9~ | 10~ | 11~ | 12 | 13~ | GND | AREF | Analog to A2 | +3V3 | Module 2 | Digital to 8 | GND | RX | TX | R | G | B | SDA | SCL | Task | SDA | SCL | ON | RX | TX | Module 1 | Module 2 | Top Silkscreen